# Altium project Carrier-Board-Apalis.PrjPcb (part 2 of 2)

## Sheet Sata.SchDoc
size A3; PageSetup: Record=PageOptions|CenterHorizontal=True|CenterVertical=True|PrintScale=0.73|XCorrection=1.00|YCorrection=1.00|PrintKind=0|BorderSize=5000000|LeftOffset=0|BottomOffset=0|Orientation=2|PaperLength=1000|PaperWidth=1000|Scale=100|PaperSource=7|PrintQuality=-4|MediaType=1|DitherType=10|PaperKind=A4|PrintScaleMode=1; Date: 27.05.2014; DrawnBy: luths8; Organization: BFH; Address1: Bern University of Applied Sciences; Address2: Engineering and Information Technology; Address3: Jlcoweg 1; Address4: CH-3400 Burgdorf; DocumentNumber: 12; Revision: 1.1; SheetNumber: 12; SheetTotal: 16; CurrentDate: 27.05.2014
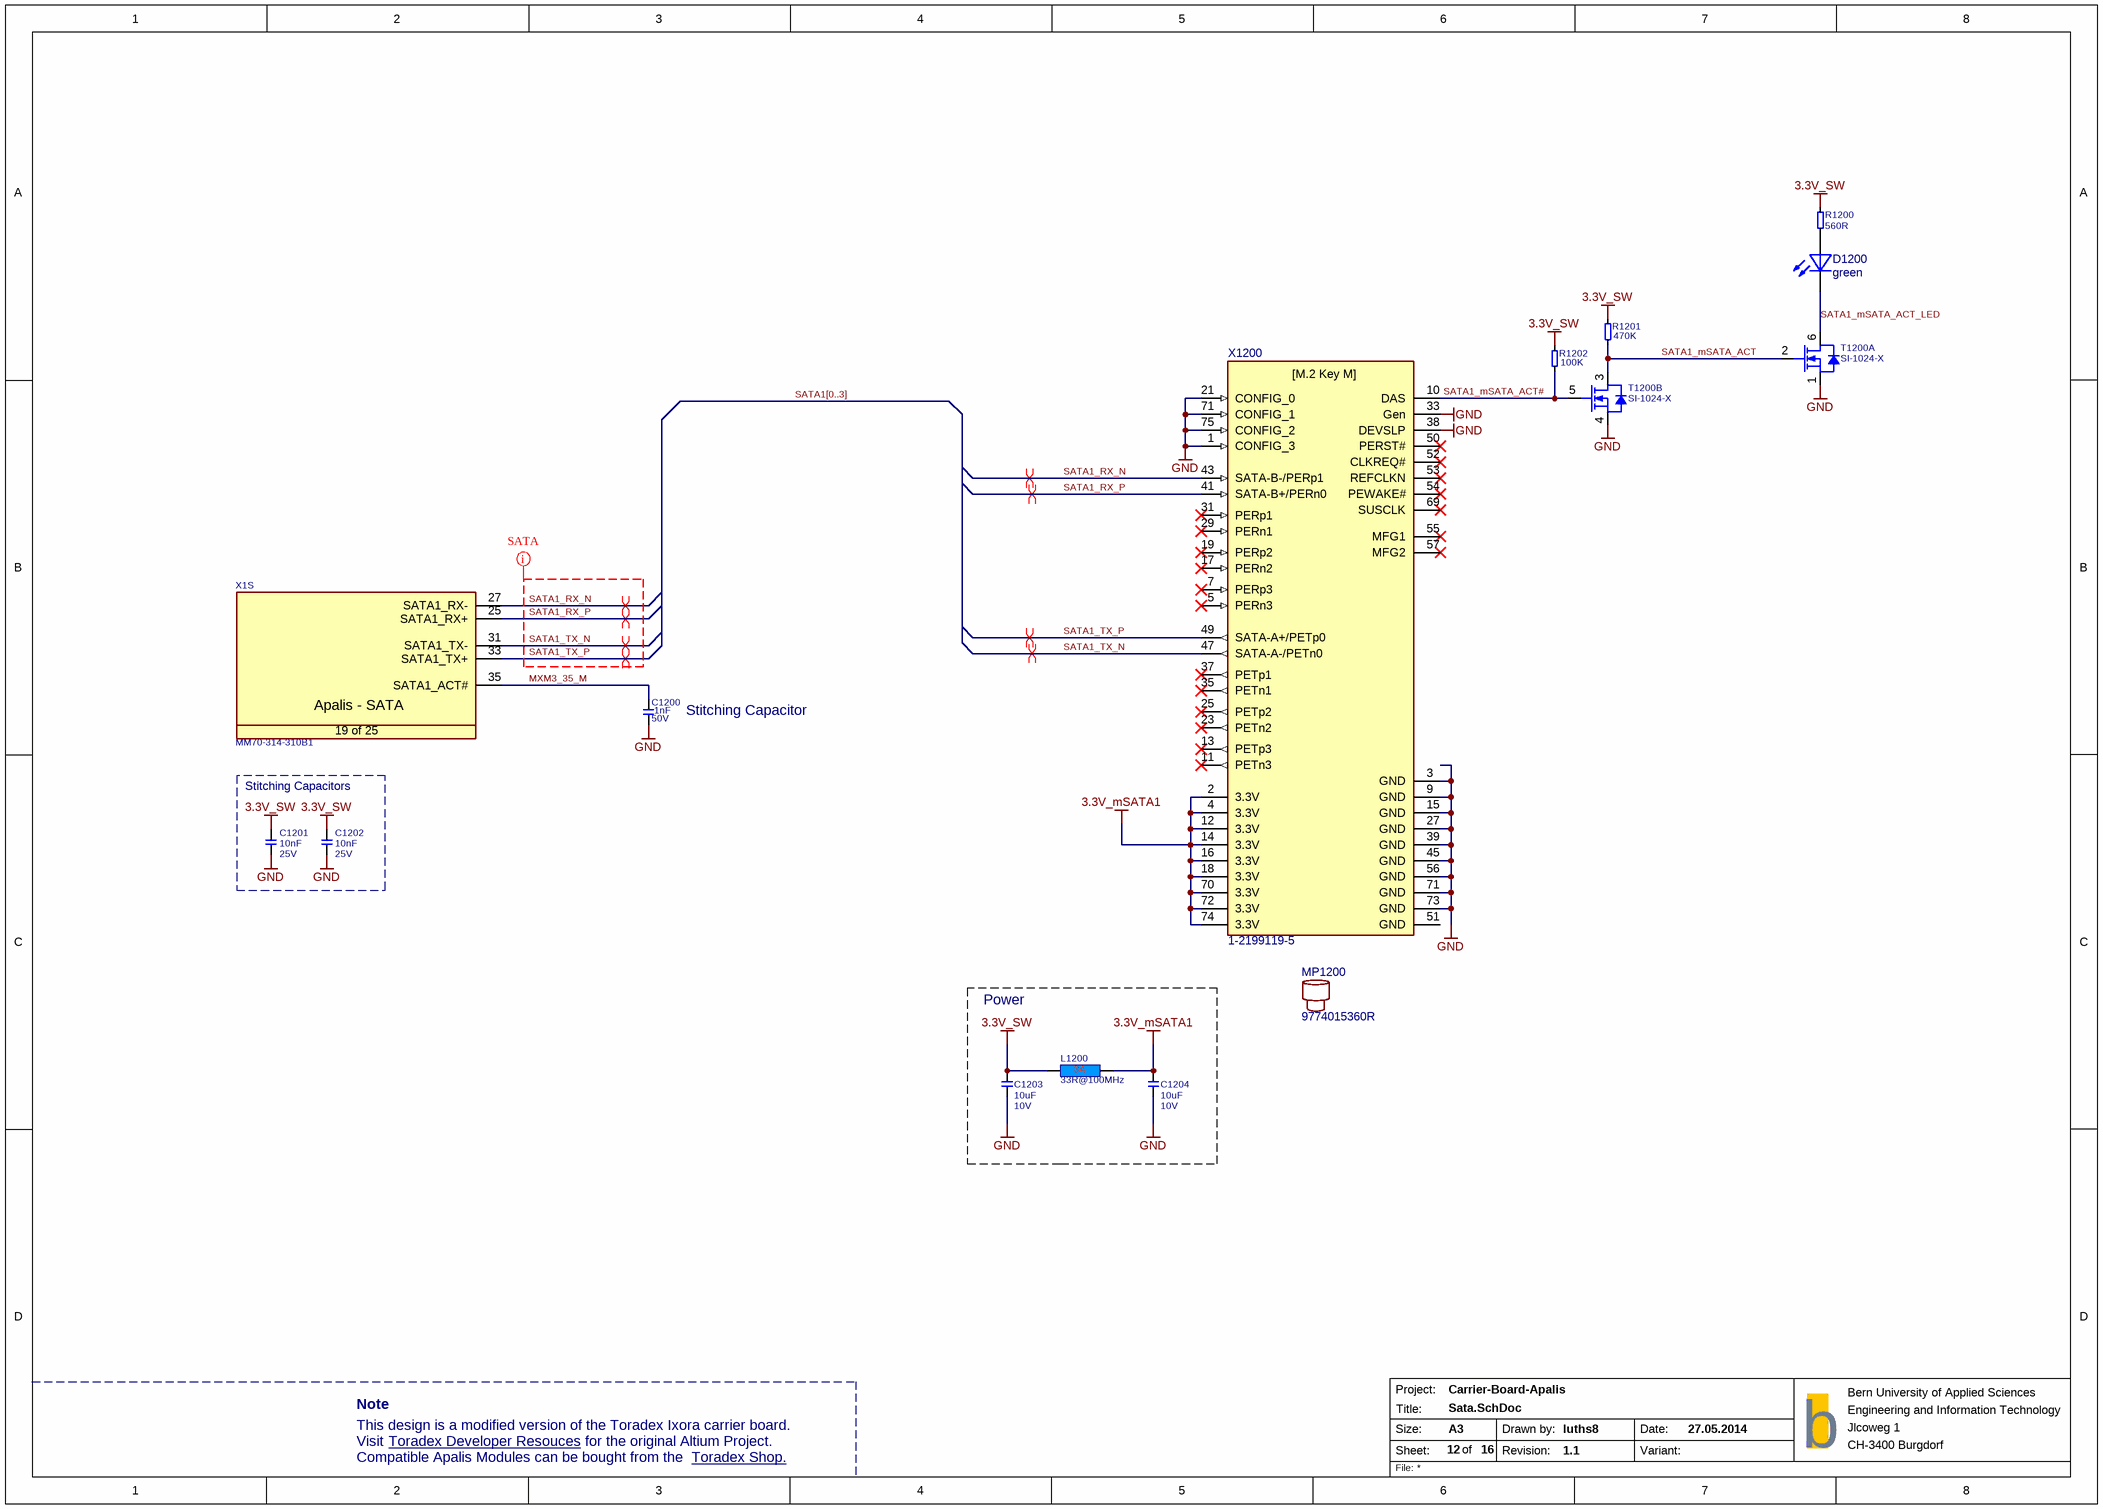
[diagram p7: Sata.SchDoc]

### Parts
C1200  Rating: 50V  [SMD0603CAP]  (hidden comment: 1nF)
C1201  10nF  Rating: 25V  [SMD0603CAP]
C1202  10nF  Rating: 25V  [SMD0603CAP]
C1203  Rating: 10V  [SMD0603CAP]  (hidden comment: 10uF)
C1204  Rating: 10V  [SMD0603CAP]  (hidden comment: 10uF)
D1200  green  [LED]
L1200  33R@100MHz  [INDC1608X95N]
MP1200  9774015360R
R1200  560R  [SMD0603RES]
R1201  470K  [SMD0603RES]
R1202  100K  [SMD0603RES]
T1200  Manufacturer Part No.: SI-1024-X  [SOTFL50P160X60-6N]  (hidden comment: T-Vishay-SI-1024X-N)  (parts A,B of 2)
X1  Manufacturer Part No.: MM70-314-310B1  [T_JAE_MM70-314-310B1]  (hidden comment: CON-JAE-MM70-314-310B1-314-0.5mm)  (part S of 25)
X1200  1-2199119-5  [1-2199119-5-Key-M-2280]

### Blocks framed on the sheet
Stitching Capacitors: C1201 C1202
Power: C1203 C1204 L1200

### Nets
3.3V_mSATA1: C1204.2 L1200.2 X1200.2(3.3V) X1200.4(3.3V) X1200.12(3.3V) X1200.14(3.3V) X1200.16(3.3V) X1200.18(3.3V) X1200.70(3.3V) X1200.72(3.3V) X1200.74(3.3V)
3.3V_SW: C1201.2 C1202.2 C1203.2 L1200.1 R1200.1 R1201.1 R1202.2
GND: C1200.1 C1201.1 C1202.1 C1203.1 C1204.1 T1200.1(S) T1200.4(S) X1200.1(CONFIG_3) X1200.3(GND) X1200.9(GND) X1200.15(GND) X1200.21(CONFIG_0) X1200.27(GND) X1200.33(Gen) X1200.38(DEVSLP) X1200.39(GND) X1200.45(GND) X1200.56(GND) X1200.71(GND) X1200.73(GND) X1200.75(CONFIG_2)
MXM3_35_M: C1200.2 X1.35(SATA1_ACT#)
SATA1_mSATA_ACT: R1201.2 T1200.2(G) T1200.3(D)
SATA1_mSATA_ACT#: R1202.1 T1200.5(G) X1200.10(DAS)
SATA1_mSATA_ACT_LED: D1200.C T1200.6(D)
SATA1_RX_N: X1.27(SATA1_RX-) X1200.43(SATA-B-/PERp1)
SATA1_RX_P: X1.25(SATA1_RX+) X1200.41(SATA-B+/PERn0)
SATA1_TX_N: X1.31(SATA1_TX-) X1200.47(SATA-A-/PETn0)
SATA1_TX_P: X1.33(SATA1_TX+) X1200.49(SATA-A+/PETp0)
NetD1200_A: D1200.A R1200.2

Not connected (* = marked no-connect by the designer): X1200 5(PERn3)* 7(PERp3)* 11(PETn3)* 13(PETp3)* 17(PERn2)* 19(PERp2)* 23(PETn2)* 25(PETp2)* 29(PERn1)* 31(PERp1)* 35(PETn1)* 37(PETp1)* 50(PERST#)* 51(GND) 52(CLKREQ#)* 53(REFCLKN)* 54(PEWAKE#)* 55(MFG1)* 57(MFG2)* 69(SUSCLK)*

### Buses and harness runs
bus SATA1[0..3]

### Layout directives
differential pair: SATA1_RX_N, SATA1_RX_P, SATA1_TX_N, SATA1_TX_P
net class SATA: SATA1_RX_N, SATA1_RX_P, SATA1_TX_N, SATA1_TX_P

### Notes on the sheet
- (near C1200) Stitching Capacitor
- Note
- This design is a modified version of the Toradex Ixora carrier board.
- Visit
- Compatible Apalis Modules can be bought from the
- Toradex Developer Resouces <https://developer.toradex.com/products/ixora-carrier-board>
- for the original Altium Project.
- Toradex Shop. <https://www.toradex.com/order-now/apalis-arm-family>
- Project:
- Size:
- Sheet:
- Title:
- A3
- of
- Drawn by:
- Revision:
- Date:
- Variant:
- b
- File:
- (in symbol CON-JAE-MM70-314-310B1-314-0.5mm, part S) Apalis - SATA; 19 of 25

### Library data of the parts
C1200 = C-X7R-1nF-50V-10%-0402: Capacitor Ceramic X7R 1nF 50V 10% 0603; Tolerance: 10%; Type: X7R; Value: 1nF
C1201 C1202 = C-X7R-10nF-25V-10%-0603: Capacitor Ceramic X7R 10nF 25V 10% 0603; Tolerance: 10%; Type: X7R; Value: 10nF
C1203 C1204 = C-X5R-10uF-10V-20%-0603: Capacitor Ceramic X5R 10uF 10V 20% 0603; Tolerance: 20%; Type: X5R; Value: 10uF
D1200 = LED green: Manufacturer Part No.: LGM67KG1J224Z
L1200 = L-33R@100MHz-3A-25%-0603: 33R@100MHz 3A EMI FILTER; Tolerance: 25%; Rating: 3A; Value: 33R@100MHz
MP1200 = Spacer M3 SMD: Manufacturer Part No.: 9774015360R
R1200 = R-560R-63mW-5%-0402: Resistor 560 ohm 63mW 5% 0603; Rating: 63mW; Tolerance: 5%; Value: 560R
R1201 = R-470KR-63mW-5%-0402: Resistor 470 Kohm 63mW 5% 0603; Value: 470KR; Rating: 63mW; Tolerance: 5%
R1202 = R-100KR-63mW-5%-0402: as R302 on sheet Power_Switch; Rating: 63mW; Tolerance: 5%
T1200 = T-Vishay-SI-1024X-N: as T302 on sheet Power_Switch
X1 = CON-JAE-MM70-314-310B1-314-0.5mm: as X1 on sheet Ethernet
X1200 = Connector M.2 Key M: Manufacturer Part No.: 1-2199119-5

## Sheet Serial.SchDoc
size A3; PageSetup: Record=PageOptions|CenterHorizontal=True|CenterVertical=True|PrintScale=0.73|XCorrection=1.00|YCorrection=1.00|PrintKind=0|BorderSize=5000000|LeftOffset=0|BottomOffset=0|Orientation=2|PaperLength=1000|PaperWidth=1000|Scale=100|PaperSource=7|PrintQuality=-4|MediaType=1|DitherType=10|PaperKind=A4|PrintScaleMode=1; Date: 27.05.2014; DrawnBy: luths8; Organization: BFH; Address1: Bern University of Applied Sciences; Address2: Engineering and Information Technology; Address3: Jlcoweg 1; Address4: CH-3400 Burgdorf; DocumentNumber: 11; Revision: 1.1; SheetNumber: 11; SheetTotal: 16; CurrentDate: 27.05.2014
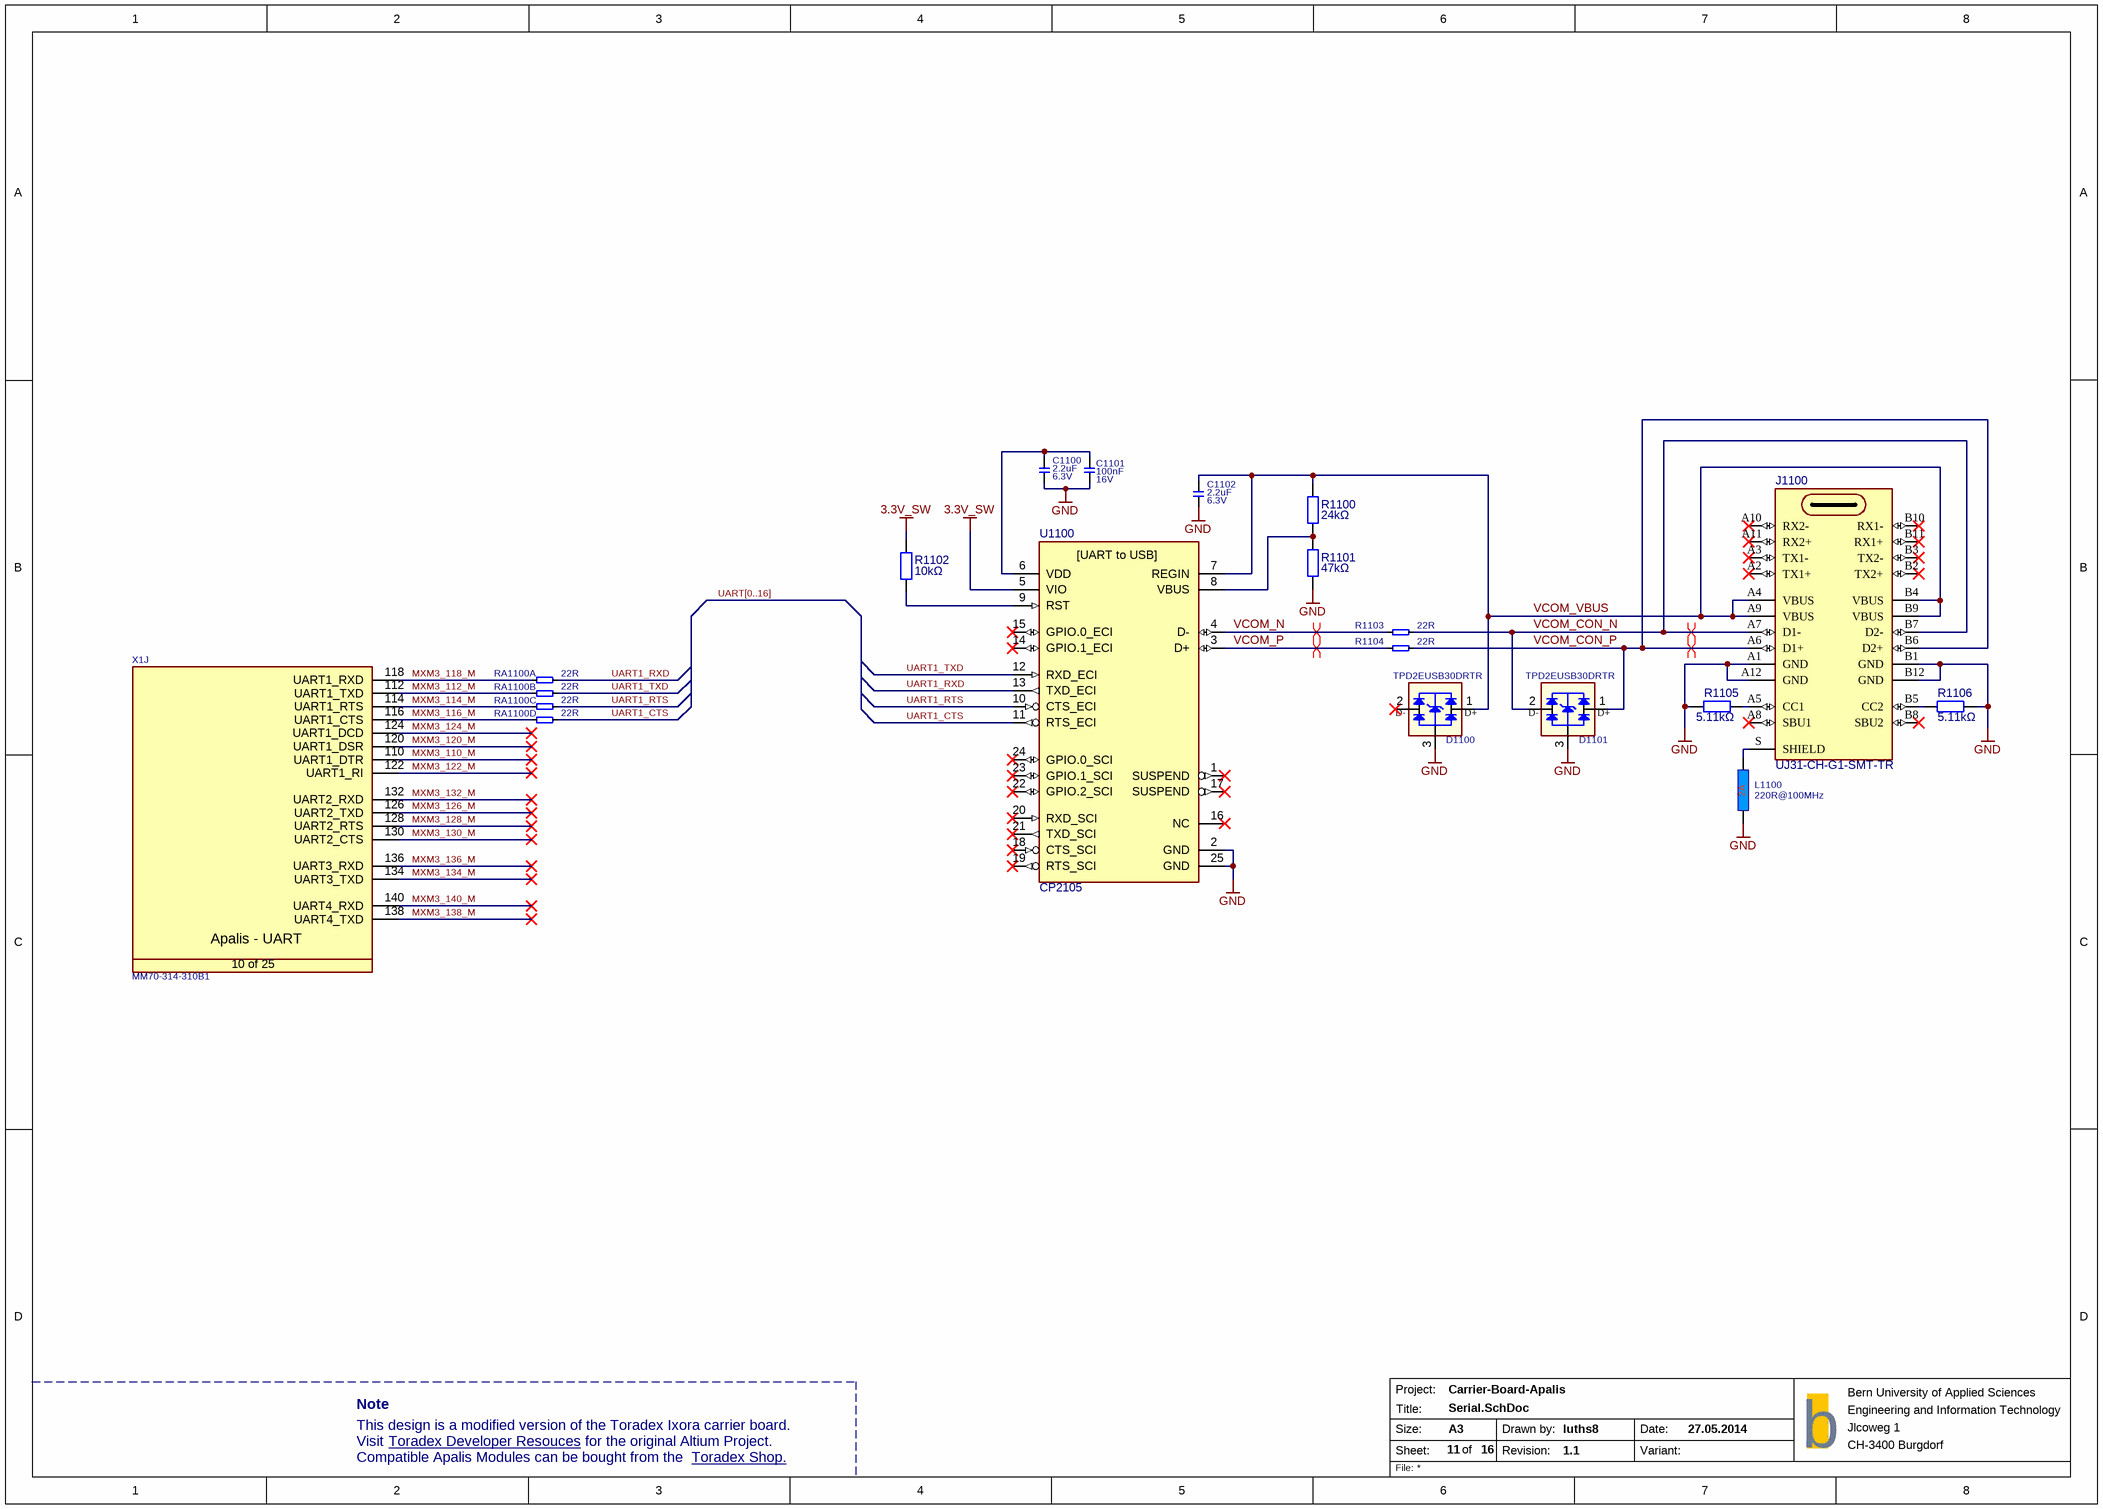
[diagram p8: Serial.SchDoc]

### Parts
C1100  Rating: 6.3V  [SMD0603CAP]  (hidden comment: 2.2uF)
C1101  Rating: 16V  [SMD0603CAP]  (hidden comment: 100nF)
C1102  Rating: 6.3V  [SMD0603CAP]  (hidden comment: 2.2uF)
D1100  TPD2EUSB30DRTR  [T_TI_TPD2EUSB30DRTR]
D1101  TPD2EUSB30DRTR  [T_TI_TPD2EUSB30DRTR]
J1100  UJ31-CH-G1-SMT-TR  [UJ31-CH-G1-SMT-TR]
L1100  220R@100MHz  [INDC1608X95N]
R1100  24kΩ  [SMD0603RES]
R1101  47kΩ  [SMD0603RES]
R1102  10kΩ  [SMD0603RES]
R1103  22R  [SMD0603RES]
R1104  22R  [SMD0603RES]
R1105  5.11kΩ  [SMD0603RES]
R1106  5.11kΩ  [SMD0603RES]
RA1100  22R  [T_Resistor_Array_X4]  (parts A,B,C,D of 4)
U1100  CP2105  [QFN24]
X1  Manufacturer Part No.: MM70-314-310B1  [T_JAE_MM70-314-310B1]  (hidden comment: CON-JAE-MM70-314-310B1-314-0.5mm)  (part J of 25)

### Nets
3.3V_SW: R1102.2 U1100.5(VIO)
GND: C1100.1 C1101.1 C1102.1 D1100.3 D1101.3 J1100.A1(GND) J1100.A12(GND) J1100.B1(GND) J1100.B12(GND) L1100.1 R1101.1 R1105.1 R1106.1 U1100.2(GND) U1100.25(GND)
MXM3_110_M: X1.110(UART1_DTR)
MXM3_112_M: RA1100.1 X1.112(UART1_TXD)
MXM3_114_M: RA1100.2 X1.114(UART1_RTS)
MXM3_116_M: RA1100.3 X1.116(UART1_CTS)
MXM3_118_M: RA1100.4 X1.118(UART1_RXD)
MXM3_120_M: X1.120(UART1_DSR)
MXM3_122_M: X1.122(UART1_RI)
MXM3_124_M: X1.124(UART1_DCD)
MXM3_126_M: X1.126(UART2_TXD)
MXM3_128_M: X1.128(UART2_RTS)
MXM3_130_M: X1.130(UART2_CTS)
MXM3_132_M: X1.132(UART2_RXD)
MXM3_134_M: X1.134(UART3_TXD)
MXM3_136_M: X1.136(UART3_RXD)
MXM3_138_M: X1.138(UART4_TXD)
MXM3_140_M: X1.140(UART4_RXD)
UART1_CTS: RA1100.7 U1100.11(RTS_ECI)
UART1_RTS: RA1100.6 U1100.10(CTS_ECI)
UART1_RXD: RA1100.8 U1100.13(TXD_ECI)
UART1_TXD: RA1100.5 U1100.12(RXD_ECI)
VCOM_CON_N: D1101.2(D-) J1100.A7(D1-) J1100.B7(D2-) R1103.2
VCOM_CON_P: D1101.1(D+) J1100.A6(D1+) J1100.B6(D2+) R1104.2
VCOM_N: R1103.1 U1100.4(D-)
VCOM_P: R1104.1 U1100.3(D+)
VCOM_VBUS: C1102.2 D1100.1(D+) J1100.A4(VBUS) J1100.A9(VBUS) J1100.B4(VBUS) J1100.B9(VBUS) R1100.2 U1100.7(REGIN)
NetC1100_2: C1100.2 C1101.2 U1100.6(VDD)
NetJ1100_A5: J1100.A5(CC1) R1105.2
NetJ1100_B5: J1100.B5(CC2) R1106.2
NetJ1100_S: J1100.S(SHIELD) L1100.2
NetR1100_1: R1100.1 R1101.2 U1100.8(VBUS)
NetR1102_1: R1102.1 U1100.9(RST)

Not connected (* = marked no-connect by the designer): D1100 2(D-)*; J1100 A2(TX1+)* A3(TX1-)* A8(SBU1)* A10(RX2-)* A11(RX2+)* B2(TX2+)* B3(TX2-)* B8(SBU2)* B10(RX1-)* B11(RX1+)*; U1100 1(SUSPEND)* 14(GPIO.1_ECI)* 15(GPIO.0_ECI)* 16(NC)* 17(SUSPEND)* 18(CTS_SCI)* 19(RTS_SCI)* 20(RXD_SCI)* 21(TXD_SCI)* 22(GPIO.2_SCI)* 23(GPIO.1_SCI)* 24(GPIO.0_SCI)*

### Buses and harness runs
bus UART[0..16]

### Layout directives
differential pair: VCOM_CON_N, VCOM_CON_P, VCOM_N, VCOM_P

### Notes on the sheet
- Note
- This design is a modified version of the Toradex Ixora carrier board.
- Visit
- Compatible Apalis Modules can be bought from the
- Toradex Developer Resouces <https://developer.toradex.com/products/ixora-carrier-board>
- for the original Altium Project.
- Toradex Shop. <https://www.toradex.com/order-now/apalis-arm-family>
- Project:
- Size:
- Sheet:
- Title:
- A3
- of
- Drawn by:
- Revision:
- Date:
- Variant:
- b
- File:
- (in symbol CON-JAE-MM70-314-310B1-314-0.5mm, part J) Apalis - UART; 10 of 25
- (in symbol CP2105) [UART to USB]

### Library data of the parts
C1100 C1102 = C-X5R-2.2uF-6.3V-20%-0603: as C329 on sheet Power_Switch; Tolerance: 20%; Type: X5R; Value: 2.2uF
C1101 = C-X7R-100nF-16V-10%-0402: Capacitor Ceramic X7R 100nF 16V 10% 0603; Tolerance: 10%; Type: X7R; Value: 100nF
D1100 D1101 = D-TI-TPD2EUSB30DRTR: 2 Channel Protection for Super Speed USB3.0; Manufacturer Name: TI; Manufacturer Part No.: TPD2EUSB30DRTR
J1100 = Connector USB C: USB Type C Jack; Manufacturer Part No.: UJ31-CH-G1-SMT-TR
L1100 = L-220R@100MHz-2A-25%-0603: as L700 on sheet Ethernet; Rating: 2A; Value: 220R@100MHz
R1100-R1102 R1105 R1106 = Resistor
R1103 R1104 = R-22R-63mW-5%-0402: Resistor 22 ohm 63mW 5% 0603; Rating: 63mW; Tolerance: 5%; Value: 22R
RA1100 = RA-22R-63mW-5%-1206-div: Resistor Array 22 R 63mW 5% 1206; Tolerance: 5%; Power Dissipation: 63mW; Value: 22R
U1100 = CP2105: USB to UART Bridge; Manufacturer Part No.: CP2105-F01-GMR
X1 = CON-JAE-MM70-314-310B1-314-0.5mm: as X1 on sheet Ethernet

## Sheet Extension.SchDoc
size A3; PageSetup: Record=PageOptions|CenterHorizontal=True|CenterVertical=True|PrintScale=0.73|XCorrection=1.00|YCorrection=1.00|PrintKind=0|BorderSize=5000000|LeftOffset=0|BottomOffset=0|Orientation=2|PaperLength=1000|PaperWidth=1000|Scale=100|PaperSource=7|PrintQuality=-4|MediaType=1|DitherType=10|PaperKind=A4|PrintScaleMode=1; Date: 27.05.2014; DrawnBy: luths8; Organization: BFH; Address1: Bern University of Applied Sciences; Address2: Engineering and Information Technology; Address3: Jlcoweg 1; Address4: CH-3400 Burgdorf; DocumentNumber: 14; Revision: 1.1; SheetNumber: 14; SheetTotal: 16; CurrentDate: 27.05.2014
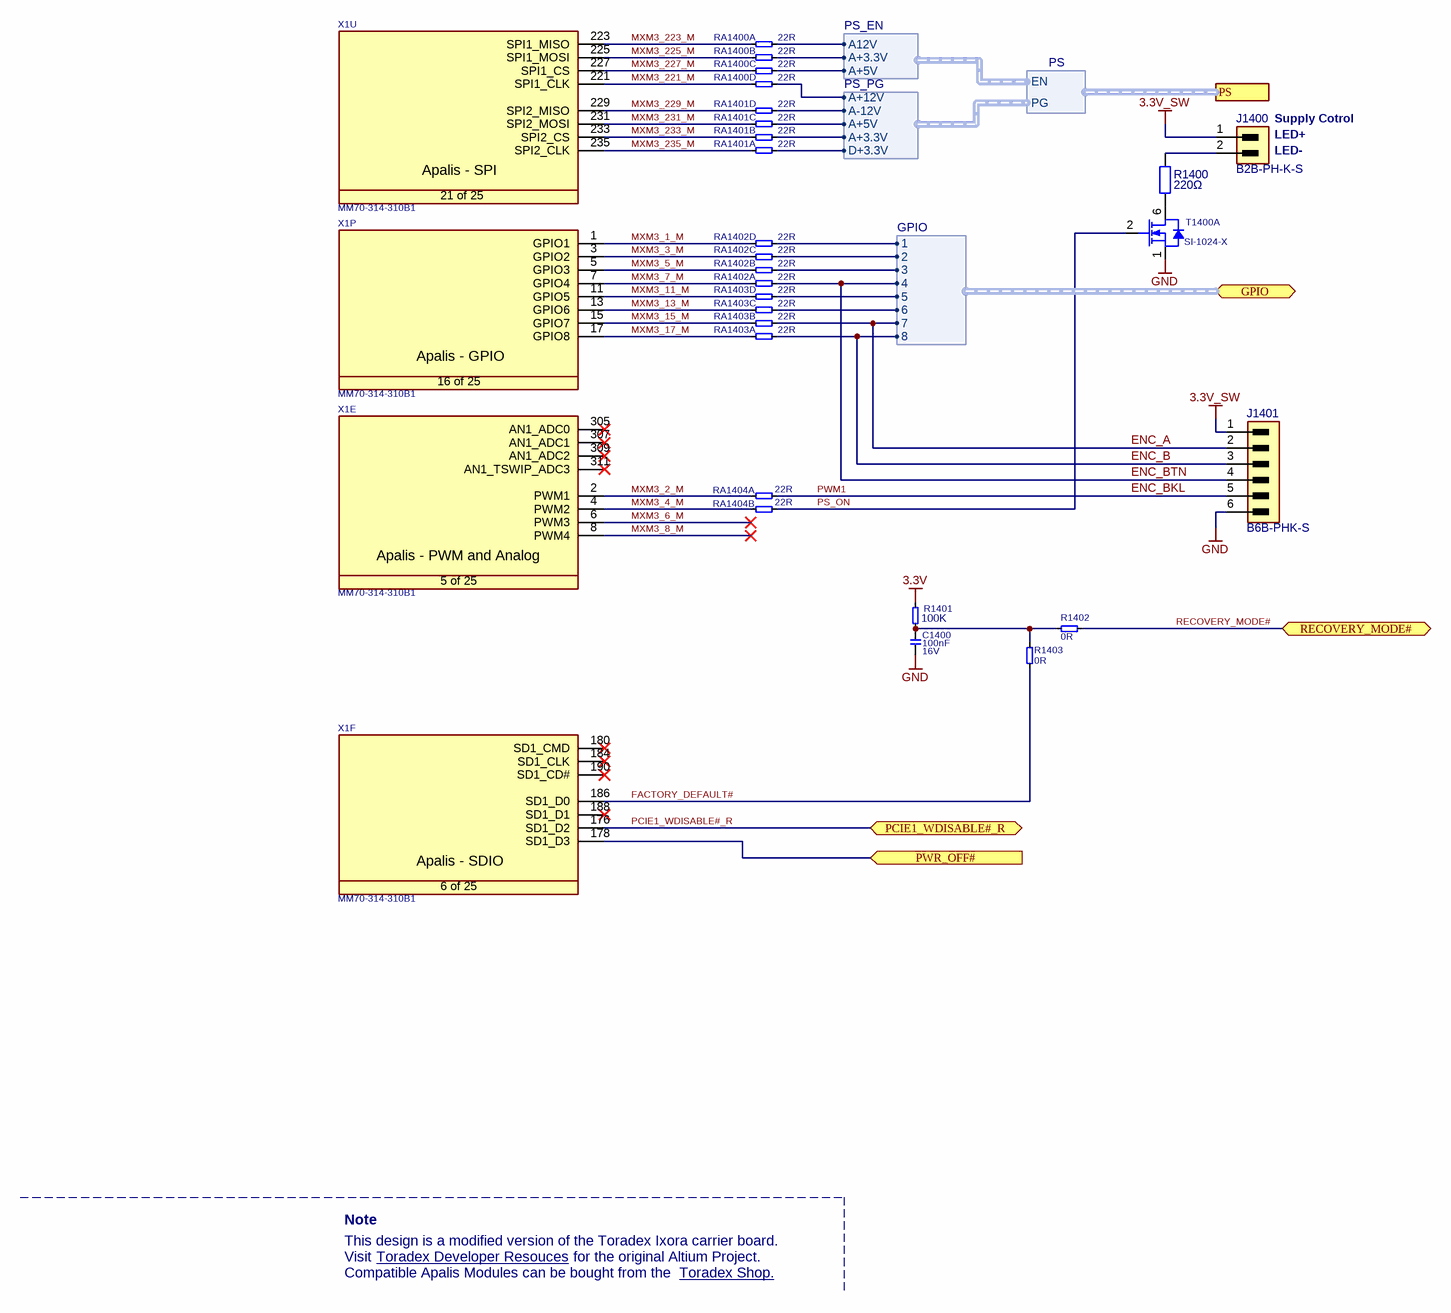
[diagram p9: Extension.SchDoc]

### Parts
C1400  Rating: 16V  [SMD0603CAP]  (hidden comment: 100nF)
J1400  B2B-PH-K-S  [B2B-PH-K-S]
J1401  B6B-PHK-S  [B6B-PH-K-S]
R1400  220Ω  [SMD0603RES]
R1401  100K  [SMD0603RES]
R1402  0R  [SMD0603RES]
R1403  0R  [SMD0603RES]
RA1400  22R  [T_Resistor_Array_X4]  (parts A,B,C,D of 4)
RA1401  22R  [T_Resistor_Array_X4]  (parts A,B,C,D of 4)
RA1402  22R  [T_Resistor_Array_X4]  (parts A,B,C,D of 4)
RA1403  22R  [T_Resistor_Array_X4]  (parts A,B,C,D of 4)
RA1404  22R  [T_Resistor_Array_X4]  (parts A,B of 4)
T1400  Manufacturer Part No.: SI-1024-X  [SOTFL50P160X60-6N]  (hidden comment: T-Vishay-SI-1024X-N)  (part A of 2)
X1  Manufacturer Part No.: MM70-314-310B1  [T_JAE_MM70-314-310B1]  (hidden comment: CON-JAE-MM70-314-310B1-314-0.5mm)  (parts E,F,P,U of 25)

### Ports
GPIO (bidir, harness GPIO, see 11, 12, 4), PCIE1_WDISABLE#_R (bidir, see 18), PS (harness PS), PWR_OFF# (in, see 18), RECOVERY_MODE# (bidir, see 11)

### Harnesses
PS: EN, PG
GPIO: 1, 2, 3, 4, 5, 6, 7, 8
PS_EN: A12V, A+3.3V, A+5V
PS_PG: A+12V, A-12V, A+3.3V, A+5V, D+3.3V

### Nets
3.3V: R1401.1
3.3V_SW: J1400.1 J1401.1
GND: C1400.1 J1401.6 T1400.1(S)
DAC_MUTE: RA1402.8 ; port GPIO.1
ENC_A: J1401.2 RA1403.6 ; port GPIO.7
ENC_B: J1401.3 RA1403.5 ; port GPIO.8
ENC_BKL: J1401.5 RA1404.1  [also labelled PWM1]
ENC_BTN: J1401.4 RA1402.5 ; port GPIO.4
FACTORY_DEFAULT#: R1403.1 X1.186(SD1_D0)
INT#: X1.178(SD1_D3) ; port PWR_OFF#
MXM3_1_M: RA1402.4 X1.1(GPIO1)
MXM3_2_M: RA1404.5 X1.2(PWM1)
MXM3_3_M: RA1402.3 X1.3(GPIO2)
MXM3_4_M: RA1404.6 X1.4(PWM2)
MXM3_5_M: RA1402.2 X1.5(GPIO3)
MXM3_6_M: X1.6(PWM3)
MXM3_7_M: RA1402.1 X1.7(GPIO4)
MXM3_8_M: X1.8(PWM4)
MXM3_11_M: RA1403.4 X1.11(GPIO5)
MXM3_13_M: RA1403.3 X1.13(GPIO6)
MXM3_15_M: RA1403.2 X1.15(GPIO7)
MXM3_17_M: RA1403.1 X1.17(GPIO8)
MXM3_221_M: RA1400.4 X1.221(SPI1_CLK)
MXM3_223_M: RA1400.1 X1.223(SPI1_MISO)
MXM3_225_M: RA1400.2 X1.225(SPI1_MOSI)
MXM3_227_M: RA1400.3 X1.227(SPI1_CS)
MXM3_229_M: RA1401.4 X1.229(SPI2_MISO)
MXM3_231_M: RA1401.3 X1.231(SPI2_MOSI)
MXM3_233_M: RA1401.2 X1.233(SPI2_CS)
MXM3_235_M: RA1401.1 X1.235(SPI2_CLK)
PCIE1_WDISABLE#_R: X1.176(SD1_D2) ; port PCIE1_WDISABLE#_R
PS_A12V_EN: RA1400.5 ; harness PS_EN.A12V
PS_A+3.3V_EN: RA1400.6 ; harness PS_EN.A+3.3V
PS_A+3.3V_PG: RA1401.6 ; harness PS_PG.A+3.3V
PS_A+5V_EN: RA1400.7 ; harness PS_EN.A+5V
PS_A+5V_PG: RA1401.7 ; harness PS_PG.A+5V
PS_A+12V_PG: RA1400.8 ; harness PS_PG.A+12V
PS_A-12V_PG: RA1401.8 ; harness PS_PG.A-12V
PS_D+3.3V_PG: RA1401.5 ; harness PS_PG.D+3.3V
PS_ON: RA1404.2 T1400.2(G)
RECOVERY_MODE#: R1402.2 ; port RECOVERY_MODE#
REF_CLK_EN_1: RA1402.7 ; port GPIO.2
REF_CLK_EN_2: RA1402.6 ; port GPIO.3
TOUCH_INT#: RA1403.8 ; port GPIO.5
TOUCH_RESET#: RA1403.7 ; port GPIO.6
NetC1400_2: C1400.2 R1401.2 R1402.1 R1403.2
NetJ1400_2: J1400.2 R1400.2
NetR1400_1: R1400.1 T1400.6(D)

Not connected (* = marked no-connect by the designer): X1 180(SD1_CMD)* 184(SD1_CLK)* 188(SD1_D1)* 190(SD1_CD#)* 305(AN1_ADC0)* 307(AN1_ADC1)* 309(AN1_ADC2)* 311(AN1_TSWIP_ADC3)*

### Notes on the sheet
- (near J1400) Supply Cotrol
- (near J1400) LED+
- (near J1400) LED-
- Note
- This design is a modified version of the Toradex Ixora carrier board.
- Visit
- Compatible Apalis Modules can be bought from the
- Toradex Developer Resouces <https://developer.toradex.com/products/ixora-carrier-board>
- for the original Altium Project.
- Toradex Shop. <https://www.toradex.com/order-now/apalis-arm-family>
- Project:
- Size:
- Sheet:
- Title:
- A3
- of
- Drawn by:
- Revision:
- Date:
- Variant:
- b
- File:
- (in symbol CON-JAE-MM70-314-310B1-314-0.5mm, part E) Apalis - PWM and Analog; 5 of 25
- (in symbol CON-JAE-MM70-314-310B1-314-0.5mm, part F) Apalis - SDIO; 6 of 25
- (in symbol CON-JAE-MM70-314-310B1-314-0.5mm, part P) Apalis - GPIO; 16 of 25
- (in symbol CON-JAE-MM70-314-310B1-314-0.5mm, part U) Apalis - SPI; 21 of 25

### Library data of the parts
C1400 = C-X7R-100nF-16V-10%-0402: Capacitor Ceramic X7R 100nF 16V 10% 0603; Tolerance: 10%; Type: X7R; Value: 100nF
J1400 = Connector 2x1P: Manufacturer Part No.: B2B-PH-K-S; System: Connector
J1401 = Connector 6x1P: Manufacturer Part No.: B6B-PHK-S; System: Connector
R1400 = Resistor
R1401 = R-100KR-63mW-5%-0402: Resistor 100 Kohm 63mW 5% 0603; Value: 100KR; Rating: 63mW; Tolerance: 5%
R1402 R1403 = R-0R-63mW-1%-0603: Resistor 0 ohm 63mW 1% 0603; Rating: 63mW; Tolerance: 1%; Value: 0R
RA1400-RA1404 = RA-22R-63mW-5%-1206-div: Resistor Array 22 R 63mW 5% 1206; Tolerance: 5%; Power Dissipation: 63mW; Value: 22R
T1400 = T-Vishay-SI-1024X-N: Dual N-Channel 20V (D-S)  MOSFET; Manufacturer Name: Vishay
X1 = CON-JAE-MM70-314-310B1-314-0.5mm: MXM3 Connector; Manufacturer Name: JAE; No. of ways: 314

## Sheet USB_Connectors.SchDoc
size A3; PageSetup: Record=PageOptions|CenterHorizontal=True|CenterVertical=True|PrintScale=0.71|XCorrection=1.00|YCorrection=1.00|PrintKind=0|BorderSize=5000000|LeftOffset=0|BottomOffset=0|Orientation=2|PaperLength=1000|PaperWidth=1000|Scale=100|PaperSource=7|PrintQuality=-4|MediaType=1|DitherType=10|PaperKind=A4|PrintScaleMode=1; Date: 27.05.2014; DrawnBy: luths8; Organization: BFH; Address1: Bern University of Applied Sciences; Address2: Engineering and Information Technology; Address3: Jlcoweg 1; Address4: CH-3400 Burgdorf; DocumentNumber: 6; Revision: 1.1; SheetNumber: 6; SheetTotal: 16; CurrentDate: 27.05.2014
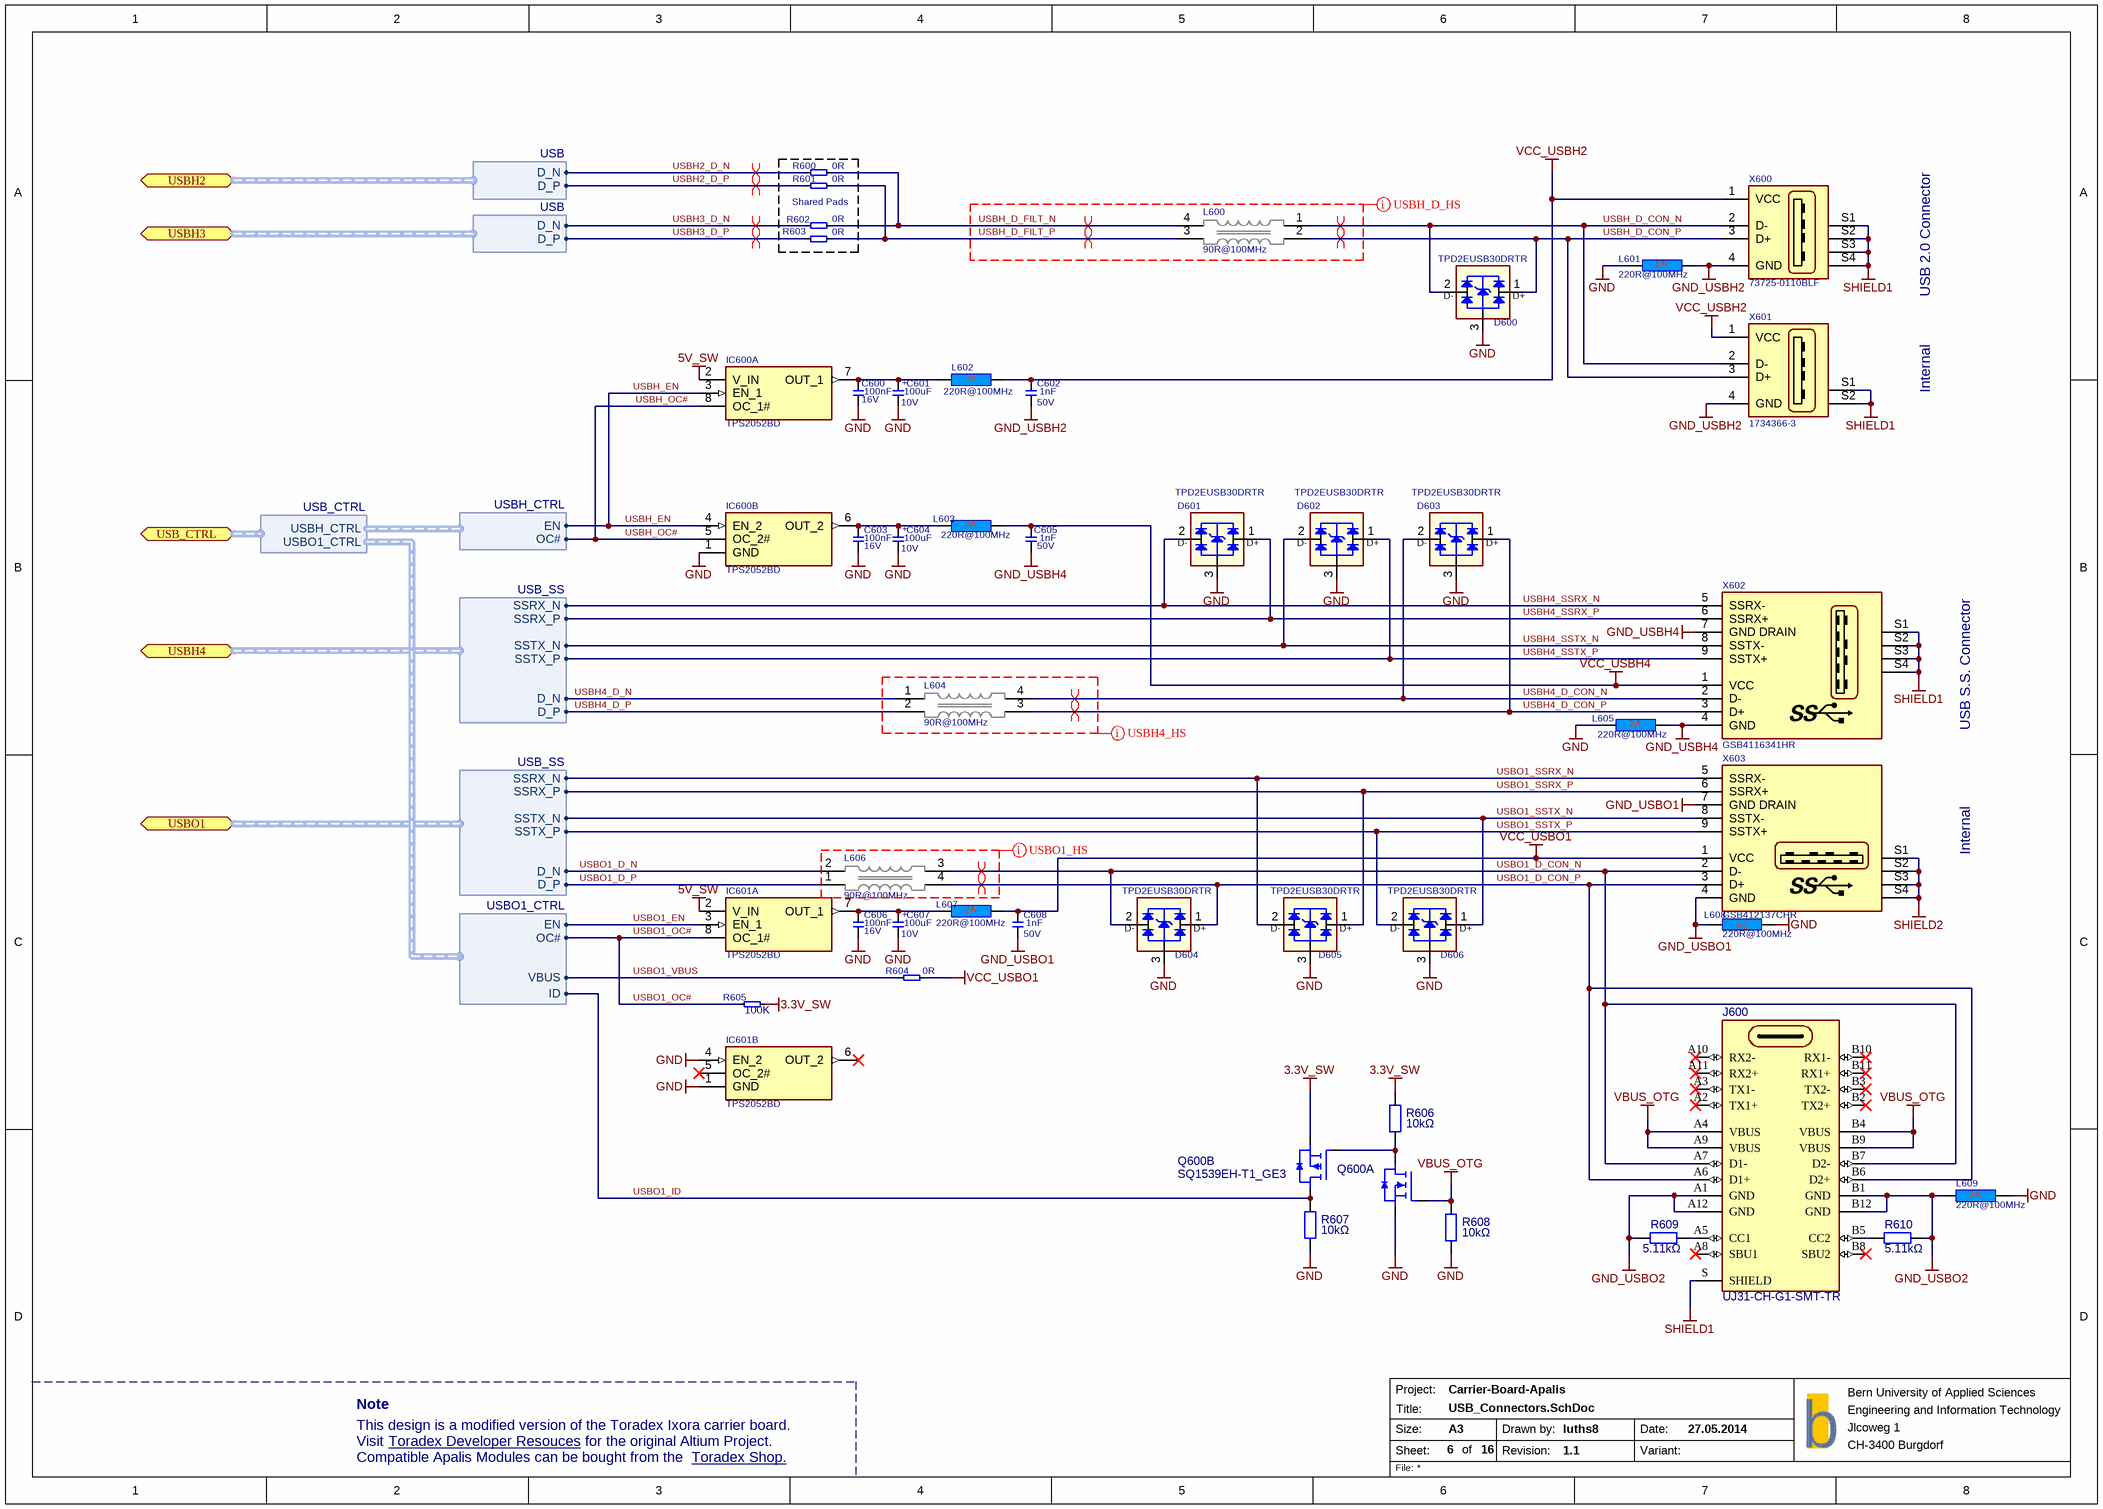
[diagram p10: USB_Connectors.SchDoc]

### Parts
C600  Rating: 16V  [SMD0603CAP]  (hidden comment: 100nF)
C601  Rating: 10V  [CAPMP6032X280N]  (hidden comment: 100uF)
C602  Rating: 50V  [SMD0603CAP]  (hidden comment: 1nF)
C603  Rating: 16V  [SMD0603CAP]  (hidden comment: 100nF)
C604  Rating: 10V  [CAPMP6032X280N]  (hidden comment: 100uF)
C605  Rating: 50V  [SMD0603CAP]  (hidden comment: 1nF)
C606  Rating: 16V  [SMD0603CAP]  (hidden comment: 100nF)
C607  Rating: 10V  [CAPMP6032X280N]  (hidden comment: 100uF)
C608  Rating: 50V  [SMD0603CAP]  (hidden comment: 1nF)
D600  TPD2EUSB30DRTR  [T_TI_TPD2EUSB30DRTR]
D601  TPD2EUSB30DRTR  [T_TI_TPD2EUSB30DRTR]
D602  TPD2EUSB30DRTR  [T_TI_TPD2EUSB30DRTR]
D603  TPD2EUSB30DRTR  [T_TI_TPD2EUSB30DRTR]
D604  TPD2EUSB30DRTR  [T_TI_TPD2EUSB30DRTR]
D605  TPD2EUSB30DRTR  [T_TI_TPD2EUSB30DRTR]
D606  TPD2EUSB30DRTR  [T_TI_TPD2EUSB30DRTR]
IC600  TPS2052BD  [SOIC127P600X173-8N]  (parts A,B of 2)
IC601  TPS2052BD  [SOIC127P600X173-8N]  (parts A,B of 2)
J600  UJ31-CH-G1-SMT-TR  [UJ31-CH-G1-SMT-TR]
L600  90R@100MHz  [T_Murata_DLW21SN900SQ2]
L601  220R@100MHz  [INDC1608X95N]
L602  220R@100MHz  [INDC1608X95N]
L603  220R@100MHz  [INDC1608X95N]
L604  90R@100MHz  [T_Murata_DLW21SN900SQ2]
L605  220R@100MHz  [INDC1608X95N]
L606  90R@100MHz  [T_Murata_DLW21SN900SQ2]
L607  220R@100MHz  [INDC1608X95N]
L608  220R@100MHz  [INDC1608X95N]
L609  220R@100MHz  [INDC1608X95N]
Q600  SQ1539EH-T1_GE3  [SOT-363-6]  (value not drawn)  (parts A,B of 2)
R600  0R  [SMD0603RES]
R601  0R  [SMD0603RES]
R602  0R  [SMD0603RES]
R603  0R  [SMD0603RES]
R604  0R  [SMD0603RES]
R605  100K  [SMD0603RES]
R606  10kΩ  [SMD0603RES]
R607  10kΩ  [SMD0603RES]
R608  10kΩ  [SMD0603RES]
R609  5.11kΩ  [SMD0603RES]
R610  5.11kΩ  [SMD0603RES]
X600  Manufacturer Part No.: 73725-0110BLF  [T_FCI_73725-0110BLF]  (hidden comment: CON-Fci-73725-0110BLF)
X601  CON-TE-1734366-3  [1734366-3]  (value not drawn)
X602  GSB4116341HR  [GSB4116341HR]
X603  GSB412137CHR  [GSB412137CHR]

### Blocks framed on the sheet
Shared Pads: R600-R603

### Ports
USB_CTRL (bidir, harness USB_CTRL), USBH2 (bidir, harness USB), USBH3 (bidir, harness USB), USBH4 (bidir, harness USB_SS), USBO1 (bidir, harness USB_SS)

### Harnesses
USB_SS: D_N, D_P, SSTX_N, SSTX_P, SSRX_N, SSRX_P
USBO1_CTRL: VBUS, ID, OC#, EN
USBH_CTRL: OC#, EN
USB_CTRL: USBO1_CTRL, USBH_CTRL
USB: D_N, D_P

### Nets
3.3V_SW: Q600.4(S) R605.2 R606.2
5V_SW: IC600.2(V_IN) IC601.2(V_IN)
GND: C600.1 C601.2 C603.1 C604.2 C606.1 C607.2 D600.3 D601.3 D602.3 D603.3 D604.3 D605.3 D606.3 IC600.1(GND) IC601.1(GND) IC601.4(EN_2) L601.1 L605.1 L608.1 L609.1 Q600.1(S) R607.1 R608.1
GND_USBH2: C602.1 L601.2 X600.4(GND) X601.4(GND)
GND_USBH4: C605.1 L605.2 X602.4(GND) X602.7(GND_DRAIN)
GND_USBO1: C608.1 L608.2 X603.4(GND) X603.7(GND_DRAIN)
GND_USBO2: J600.A1(GND) J600.A12(GND) J600.B1(GND) J600.B12(GND) L609.2 R609.1 R610.1
SHIELD1: J600.S(SHIELD) X600.S1 X600.S2 X600.S3 X600.S4 X601.S1 X601.S2 X602.S1 X602.S2 X602.S3 X602.S4
SHIELD2: X603.S1 X603.S2 X603.S3 X603.S4
VBUS_OTG: J600.A4(VBUS) J600.A9(VBUS) J600.B4(VBUS) J600.B9(VBUS) Q600.2(G) R608.2
VCC_USBH2: C602.2 L602.2 X600.1(VCC) X601.1(VCC)
VCC_USBH4: C605.2 L603.2 X602.1(VCC)
VCC_USBO1: C608.2 L607.2 R604.2 X603.1(VCC)
USBH2_D_N: R600.1 ; port USBH2.D_N
USBH2_D_P: R601.1 ; port USBH2.D_P
USBH3_D_N: R602.1 ; port USBH3.D_N
USBH3_D_P: R603.1 ; port USBH3.D_P
USBH4_D_CON_N: D603.2(D-) L604.4 X602.2(D-)
USBH4_D_CON_P: D603.1(D+) L604.3 X602.3(D+)
USBH4_D_N: L604.1 ; port USBH4.D_N
USBH4_D_P: L604.2 ; port USBH4.D_P
USBH4_SSRX_N: D601.2(D-) X602.5(SSRX-) ; port USBH4.SSRX_N
USBH4_SSRX_P: D601.1(D+) X602.6(SSRX+) ; port USBH4.SSRX_P
USBH4_SSTX_N: D602.2(D-) X602.8(SSTX-) ; port USBH4.SSTX_N
USBH4_SSTX_P: D602.1(D+) X602.9(SSTX+) ; port USBH4.SSTX_P
USBH_D_CON_N: D600.2(D-) L600.1 X600.2(D-) X601.2(D-)
USBH_D_CON_P: D600.1(D+) L600.2 X600.3(D+) X601.3(D+)
USBH_D_FILT_N: L600.4 R600.2 R602.2
USBH_D_FILT_P: L600.3 R601.2 R603.2
USBH_EN: IC600.3(EN_1) IC600.4(EN_2) ; harness USBH_CTRL.EN
USBH_OC#: IC600.5(OC_2#) IC600.8(OC_1#) ; harness USBH_CTRL.OC#
USBO1_D_CON_N: D604.2(D-) J600.A7(D1-) J600.B7(D2-) L606.3 X603.2(D-)
USBO1_D_CON_P: D604.1(D+) J600.A6(D1+) J600.B6(D2+) L606.4 X603.3(D+)
USBO1_D_N: L606.2 ; port USBO1.D_N
USBO1_D_P: L606.1 ; port USBO1.D_P
USBO1_EN: IC601.3(EN_1) ; harness USBO1_CTRL.EN
USBO1_ID: Q600.3(D) R607.2 ; harness USBO1_CTRL.ID
USBO1_OC#: IC601.8(OC_1#) R605.1 ; harness USBO1_CTRL.OC#
USBO1_SSRX_N: D605.2(D-) X603.5(SSRX-) ; port USBO1.SSRX_N
USBO1_SSRX_P: D605.1(D+) X603.6(SSRX+) ; port USBO1.SSRX_P
USBO1_SSTX_N: D606.1(D+) X603.8(SSTX-) ; port USBO1.SSTX_N
USBO1_SSTX_P: D606.2(D-) X603.9(SSTX+) ; port USBO1.SSTX_P
USBO1_VBUS: R604.1 ; harness USBO1_CTRL.VBUS
NetC600_2: C600.2 C601.1 IC600.7(OUT_1) L602.1
NetC603_2: C603.2 C604.1 IC600.6(OUT_2) L603.1
NetC606_2: C606.2 C607.1 IC601.7(OUT_1) L607.1
NetJ600_A5: J600.A5(CC1) R609.2
NetJ600_B5: J600.B5(CC2) R610.2
NetQ600_5: Q600.5(G) Q600.6(D) R606.1

Not connected (* = marked no-connect by the designer): IC601 5(OC_2#)* 6(OUT_2)*; J600 A2(TX1+)* A3(TX1-)* A8(SBU1)* A10(RX2-)* A11(RX2+)* B2(TX2+)* B3(TX2-)* B8(SBU2)* B10(RX1-)* B11(RX1+)*

### Layout directives
differential pair: USBH2_D_N, USBH2_D_P, USBH3_D_N, USBH3_D_P, USBH4_D_CON_N, USBH4_D_CON_P, USBH_D_CON_N, USBH_D_CON_P, USBH_D_FILT_N, USBH_D_FILT_P, USBO1_D_CON_N, USBO1_D_CON_P
net class USBO1_HS: (no net found under the mark)
net class USBH4_HS: (no net found under the mark)
net class USBH_D_HS: USBH_D_FILT_N, USBH_D_FILT_P

### Notes on the sheet
- USB 2.0 Connector
- Internal
- USB S.S. Connector
- Note
- This design is a modified version of the Toradex Ixora carrier board.
- Visit
- Compatible Apalis Modules can be bought from the
- Toradex Developer Resouces <https://developer.toradex.com/products/ixora-carrier-board>
- for the original Altium Project.
- Toradex Shop. <https://www.toradex.com/order-now/apalis-arm-family>
- Project:
- Size:
- Sheet:
- Title:
- A3
- of
- Drawn by:
- Revision:
- Date:
- Variant:
- b
- File:
- (in symbol C-TA-100uF-10V-10%-6032) +

### Library data of the parts
C600 C603 C606 = C-X7R-100nF-16V-10%-0402: Capacitor Ceramic X7R 100nF 16V 10% 0603; Tolerance: 10%; Type: X7R; Value: 100nF
C601 C604 C607 = C-TA-100uF-10V-10%-6032: Capacitor TA 100uF 10V 10% 6032; Tolerance: 10%; Type: TA; Value: 100uF
C602 C605 C608 = C-X7R-1nF-50V-10%-0402: Capacitor Ceramic X7R 1nF 50V 10% 0603; Tolerance: 10%; Type: X7R; Value: 1nF
D600-D606 = D-TI-TPD2EUSB30DRTR: 2 Channel Protection for Super Speed USB3.0; Manufacturer Name: TI; Manufacturer Part No.: TPD2EUSB30DRTR
IC600 IC601 = IC-TI-TPS2052BD: Dual High Side Switch With OC_DET 500mA/CH; Manufacturer Name: Texas Instruments; Manufacturer Part No.: TPS2052BD
J600 = Connector USB C: USB Type C Jack; Manufacturer Part No.: UJ31-CH-G1-SMT-TR
L600 L604 L606 = L-Murata-DLW21SN900SQ2-90R@100MHz-330mA-25%: Common Mode Choke High Speed 90R 330mA; Manufacturer Name: Murata; Tolerance: 25%; Rating: 330mA; Manufacturer Part No.: DLW21SN900SQ2; Value: 90R@100MHz
L601-L603 L605 L607-L609 = L-220R@100MHz-2A-25%-0603: 220R@100MHz 2A EMI FILTER; Tolerance: 25%; Rating: 2A; Value: 220R@100MHz
Q600 = Transistor N/PMOS Dual: Transistor Dual, NMOS & PMOS; Manufacturer Part No.: SQ1539EH-T1_GE3
R600-R603 = R-0R-63mW-1%-0603: Resistor 0 ohm 63mW 1% 0603; Rating: 63mW; Tolerance: 1%; Value: 0R
R604 = R-0R-63mW-1%-0402: Resistor 0 ohm 63mW 1% 0603; Rating: 63mW; Tolerance: 1%; Value: 0R
R605 = R-100KR-63mW-5%-0402: as R1401 on sheet Extension; Rating: 63mW; Tolerance: 5%
R606-R610 = Resistor
X600 = CON-Fci-73725-0110BLF: USB Type A Connector; Manufacturer Name: FCI; No. of ways: 4; System: Connector
X601 = CON-TE-1734366-3: USB Type A Connector Vertical; Manufacturer Name: TE; Manufacturer Part No.: 1734366-3; System: Connector
X602 = CON-Amphenol-GSB4116341HR: USB 3.1, Type A, sideways; System: Connector; Manufacturer Name: Amphenol; Manufacturer Part No.: GSB4116341HR
X603 = CON-Amphenol-GSB412137CHR: USB 3.1, Type A, vertical; System: Connector; Manufacturer Name: Amphenol; Manufacturer Part No.: GSB412137CHR

## Sheet USB.SchDoc
size A3; PageSetup: Record=PageOptions|CenterHorizontal=True|CenterVertical=True|PrintScale=0.73|XCorrection=1.00|YCorrection=1.00|PrintKind=0|BorderSize=5000000|LeftOffset=0|BottomOffset=0|Orientation=2|PaperLength=1000|PaperWidth=1000|Scale=100|PaperSource=7|PrintQuality=-4|MediaType=1|DitherType=10|PaperKind=A4|PrintScaleMode=1; Date: 27.05.2014; DrawnBy: luths8; Organization: BFH; Address1: Bern University of Applied Sciences; Address2: Engineering and Information Technology; Address3: Jlcoweg 1; Address4: CH-3400 Burgdorf; DocumentNumber: 5; Revision: 1.1; SheetNumber: 5; SheetTotal: 16; CurrentDate: 27.05.2014
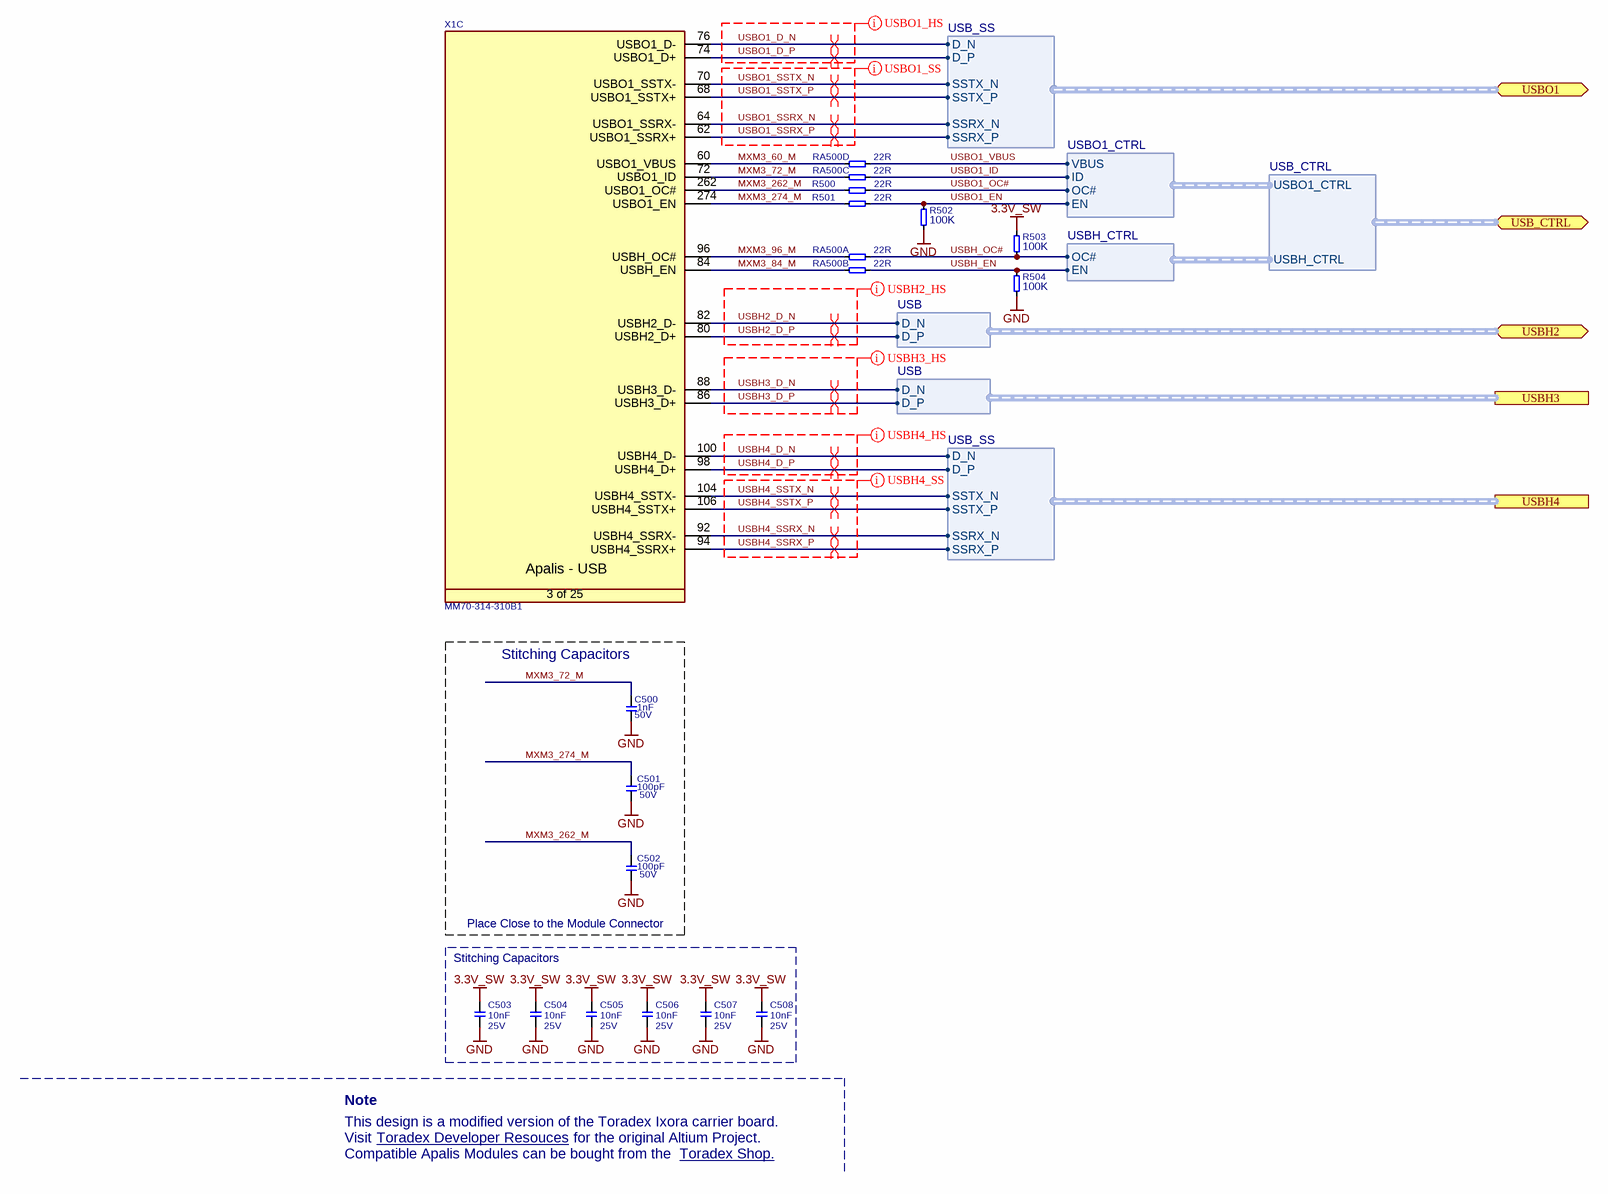
[diagram p11: USB.SchDoc]

### Parts
C500  Rating: 50V  [SMD0603CAP]  (hidden comment: 1nF)
C501  Rating: 50V  [SMD0603CAP]  (hidden comment: 100pF)
C502  Rating: 50V  [SMD0603CAP]  (hidden comment: 100pF)
C503  10nF  Rating: 25V  [SMD0603CAP]
C504  10nF  Rating: 25V  [SMD0603CAP]
C505  10nF  Rating: 25V  [SMD0603CAP]
C506  10nF  Rating: 25V  [SMD0603CAP]
C507  10nF  Rating: 25V  [SMD0603CAP]
C508  10nF  Rating: 25V  [SMD0603CAP]
R500  22R  [SMD0603RES]
R501  22R  [SMD0603RES]
R502  100K  [SMD0603RES]
R503  100K  [SMD0603RES]
R504  100K  [SMD0603RES]
RA500  22R  [T_Resistor_Array_X4]  (parts A,B,C,D of 4)
X1  Manufacturer Part No.: MM70-314-310B1  [T_JAE_MM70-314-310B1]  (hidden comment: CON-JAE-MM70-314-310B1-314-0.5mm)  (part C of 25)

### Blocks framed on the sheet
Stitching Capacitors: C500-C502

### Ports
USB_CTRL (bidir, harness USB_CTRL), USBH2 (bidir, harness USB), USBH3 (harness USB), USBH4 (harness USB_SS), USBO1 (bidir, harness USB_SS)

### Harnesses
USB_SS: D_N, D_P, SSTX_N, SSTX_P, SSRX_N, SSRX_P
USB: D_N, D_P
USBO1_CTRL: VBUS, ID, OC#, EN
USBH_CTRL: OC#, EN
USB_CTRL: USBO1_CTRL, USBH_CTRL

### Nets
3.3V_SW: C503.2 C504.2 C505.2 C506.2 C507.2 C508.2 R503.1
GND: C500.1 C501.1 C502.1 C503.1 C504.1 C505.1 C506.1 C507.1 C508.1 R502.1 R504.1
MXM3_60_M: RA500.1 X1.60(USBO1_VBUS)
MXM3_72_M: C500.2 RA500.2 X1.72(USBO1_ID)
MXM3_84_M: RA500.3 X1.84(USBH_EN)
MXM3_96_M: RA500.4 X1.96(USBH_OC#)
MXM3_262_M: C502.2 R500.1 X1.262(USBO1_OC#)
MXM3_274_M: C501.2 R501.1 X1.274(USBO1_EN)
USBH2_D_N: X1.82(USBH2_D-) ; port USBH2.D_N
USBH2_D_P: X1.80(USBH2_D+) ; port USBH2.D_P
USBH3_D_N: X1.88(USBH3_D-) ; port USBH3.D_N
USBH3_D_P: X1.86(USBH3_D+) ; port USBH3.D_P
USBH4_D_N: X1.100(USBH4_D-) ; port USBH4.D_N
USBH4_D_P: X1.98(USBH4_D+) ; port USBH4.D_P
USBH4_SSRX_N: X1.92(USBH4_SSRX-) ; port USBH4.SSRX_N
USBH4_SSRX_P: X1.94(USBH4_SSRX+) ; port USBH4.SSRX_P
USBH4_SSTX_N: X1.104(USBH4_SSTX-) ; port USBH4.SSTX_N
USBH4_SSTX_P: X1.106(USBH4_SSTX+) ; port USBH4.SSTX_P
USBH_EN: R504.2 RA500.7 ; harness USBH_CTRL.EN
USBH_OC#: R503.2 RA500.8 ; harness USBH_CTRL.OC#
USBO1_D_N: X1.76(USBO1_D-) ; port USBO1.D_N
USBO1_D_P: X1.74(USBO1_D+) ; port USBO1.D_P
USBO1_EN: R501.2 R502.2 ; harness USBO1_CTRL.EN
USBO1_ID: RA500.6 ; harness USBO1_CTRL.ID
USBO1_OC#: R500.2 ; harness USBO1_CTRL.OC#
USBO1_SSRX_N: X1.64(USBO1_SSRX-) ; port USBO1.SSRX_N
USBO1_SSRX_P: X1.62(USBO1_SSRX+) ; port USBO1.SSRX_P
USBO1_SSTX_N: X1.70(USBO1_SSTX-) ; port USBO1.SSTX_N
USBO1_SSTX_P: X1.68(USBO1_SSTX+) ; port USBO1.SSTX_P
USBO1_VBUS: RA500.5 ; harness USBO1_CTRL.VBUS

### Layout directives
differential pair: USBH2_D_N, USBH2_D_P, USBH3_D_N, USBH3_D_P, USBH4_D_N, USBH4_D_P, USBH4_SSRX_N, USBH4_SSRX_P, USBH4_SSTX_N, USBH4_SSTX_P, USBO1_D_N, USBO1_D_P, USBO1_SSRX_N, USBO1_SSRX_P, USBO1_SSTX_N, USBO1_SSTX_P
net class USBO1_SS: USBO1_SSRX_N, USBO1_SSRX_P, USBO1_SSTX_N, USBO1_SSTX_P
net class USBO1_HS: USBO1_D_N, USBO1_D_P
net class USBH2_HS: USBH2_D_N, USBH2_D_P
net class USBH3_HS: USBH3_D_N, USBH3_D_P
net class USBH4_SS: USBH4_SSRX_N, USBH4_SSRX_P, USBH4_SSTX_N, USBH4_SSTX_P
net class USBH4_HS: USBH4_D_N, USBH4_D_P

### Notes on the sheet
- (near C502) Place Close to the Module Connector
- Stitching Capacitors
- Note
- This design is a modified version of the Toradex Ixora carrier board.
- Visit
- Compatible Apalis Modules can be bought from the
- Toradex Developer Resouces <https://developer.toradex.com/products/ixora-carrier-board>
- for the original Altium Project.
- Toradex Shop. <https://www.toradex.com/order-now/apalis-arm-family>
- Project:
- Size:
- Sheet:
- Title:
- A3
- of
- Drawn by:
- Revision:
- Date:
- Variant:
- b
- File:
- (in symbol CON-JAE-MM70-314-310B1-314-0.5mm, part C) Apalis - USB; 3 of 25

### Library data of the parts
C500 = C-X7R-1nF-50V-10%-0402: Capacitor Ceramic X7R 1nF 50V 10% 0603; Tolerance: 10%; Type: X7R; Value: 1nF
C501 C502 = C-X7R-100pF-50V-10%-0402: Capacitor Ceramic X7R 100pF 50V 10% 0603; Tolerance: 10%; Type: X7R; Value: 100pF
C503-C508 = C-X7R-10nF-25V-10%-0603: Capacitor Ceramic X7R 10nF 25V 10% 0603; Tolerance: 10%; Type: X7R; Value: 10nF
R500 R501 = R-22R-63mW-5%-0402: Resistor 22 ohm 63mW 5% 0603; Rating: 63mW; Tolerance: 5%; Value: 22R
R502-R504 = R-100KR-63mW-5%-0402: as R1401 on sheet Extension; Rating: 63mW; Tolerance: 5%
RA500 = RA-22R-63mW-5%-1206-div: Resistor Array 22 R 63mW 5% 1206; Tolerance: 5%; Power Dissipation: 63mW; Value: 22R
X1 = CON-JAE-MM70-314-310B1-314-0.5mm: as X1 on sheet Extension

## Sheet HDMI.SchDoc
size A3; PageSetup: Record=PageOptions|CenterHorizontal=True|CenterVertical=True|PrintScale=0.73|XCorrection=1.00|YCorrection=1.00|PrintKind=0|BorderSize=5000000|LeftOffset=0|BottomOffset=0|Orientation=2|PaperLength=1000|PaperWidth=1000|Scale=100|PaperSource=7|PrintQuality=-4|MediaType=1|DitherType=10|PaperKind=A4|PrintScaleMode=1; Date: 27.05.2014; DrawnBy: luths8; Organization: BFH; Address1: Bern University of Applied Sciences; Address2: Engineering and Information Technology; Address3: Jlcoweg 1; Address4: CH-3400 Burgdorf; DocumentNumber: 10; Revision: 1.1; SheetNumber: 10; SheetTotal: 16; CurrentDate: 27.05.2014
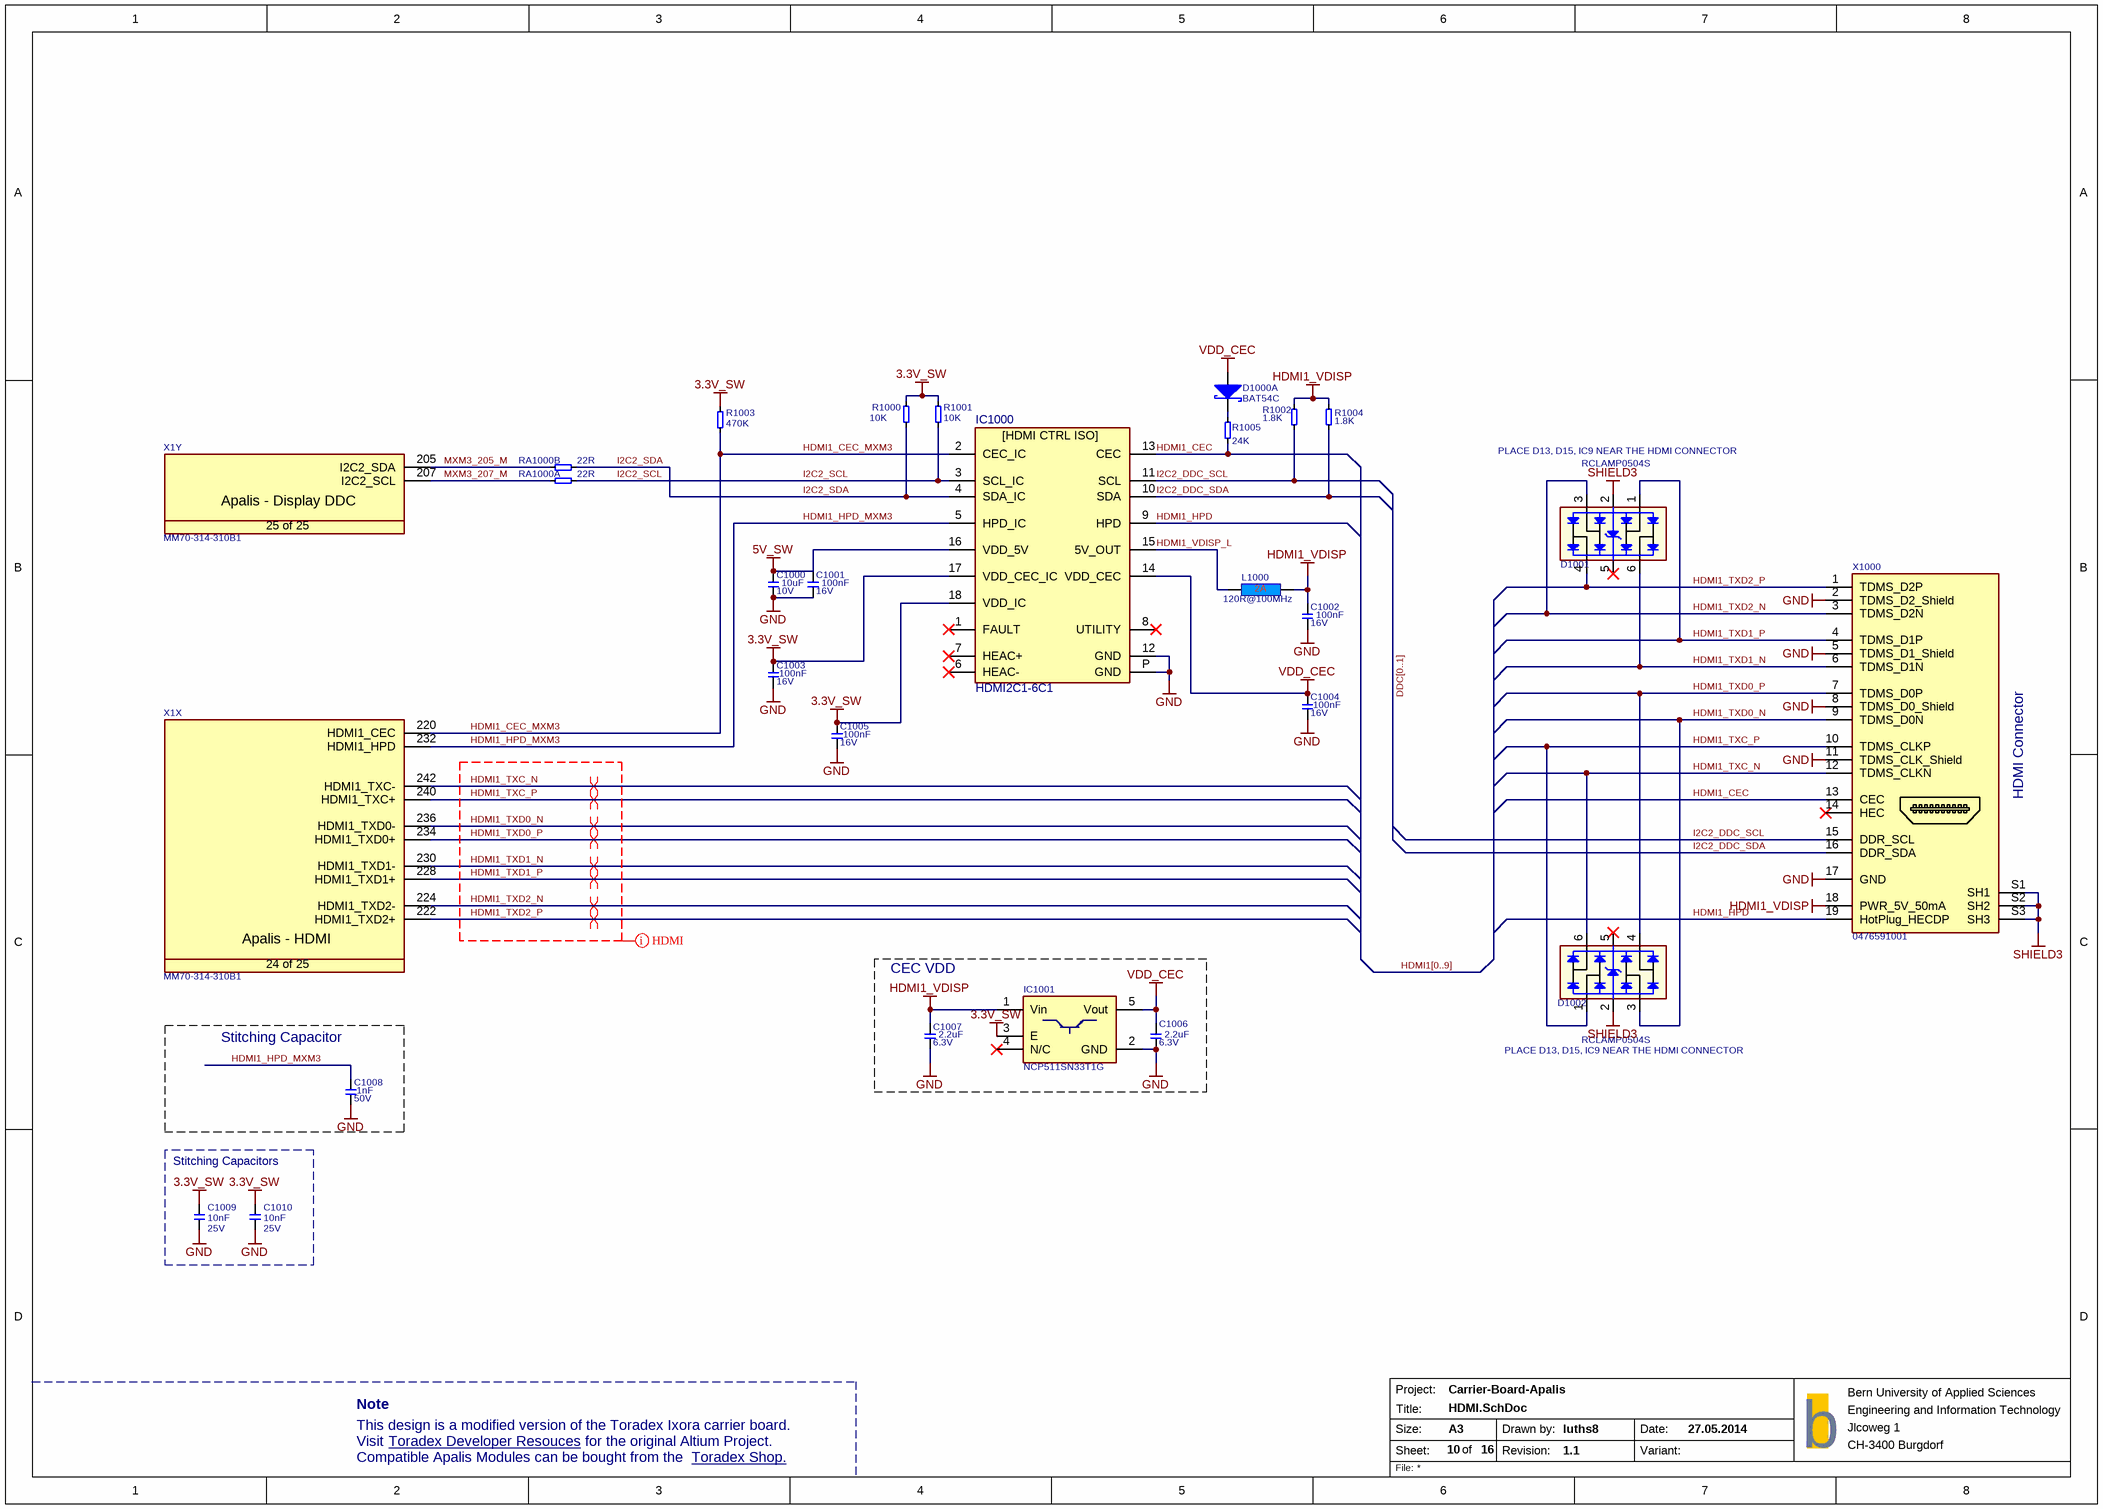
[diagram p12: HDMI.SchDoc]

### Parts
C1000  Rating: 10V  [SMD0603CAP]  (hidden comment: 10uF)
C1001  Rating: 16V  [SMD0603CAP]  (hidden comment: 100nF)
C1002  Rating: 16V  [SMD0603CAP]  (hidden comment: 100nF)
C1003  Rating: 16V  [SMD0603CAP]  (hidden comment: 100nF)
C1004  Rating: 16V  [SMD0603CAP]  (hidden comment: 100nF)
C1005  Rating: 16V  [SMD0603CAP]  (hidden comment: 100nF)
C1006  Rating: 6.3V  [SMD0603CAP]  (hidden comment: 2.2uF)
C1007  Rating: 6.3V  [SMD0603CAP]  (hidden comment: 2.2uF)
C1008  Rating: 50V  [SMD0603CAP]  (hidden comment: 1nF)
C1009  10nF  Rating: 25V  [SMD0603CAP]
C1010  10nF  Rating: 25V  [SMD0603CAP]
D1000  BAT54C  [SOT95P230X110-3N]  (part A of 2)
D1001  RCLAMP0504S  [T_SOT95P285X90-6N]
D1002  RCLAMP0504S  [T_SOT95P285X90-6N]
IC1000  HDMI2C1-6C1  [QFN18]
IC1001  NCP511SN33T1G  [SOT95P279X142-5N]
L1000  120R@100MHz  [INDC1608X95N]
R1000  10K  [SMD0603RES]
R1001  10K  [SMD0603RES]
R1002  1.8K  [SMD0603RES]
R1003  470K  [SMD0603RES]
R1004  1.8K  [SMD0603RES]
R1005  24K  [SMD0603RES]
RA1000  22R  [T_Resistor_Array_X4]  (parts A,B of 4)
X1  Manufacturer Part No.: MM70-314-310B1  [T_JAE_MM70-314-310B1]  (hidden comment: CON-JAE-MM70-314-310B1-314-0.5mm)  (parts X,Y of 25)
X1000  0476591001  [0476591001]

### Blocks framed on the sheet
CEC VDD: C1006 C1007 IC1001
Stitching Capacitor: C1008
Stitching Capacitors: C1009 C1010

### Nets
3.3V_SW: C1003.2 C1005.2 C1009.2 C1010.2 IC1000.17(VDD_CEC_IC) IC1000.18(VDD_IC) IC1001.3(E) R1000.2 R1001.2 R1003.2
5V_SW: C1000.2 C1001.1 IC1000.16(VDD_5V)
GND: C1000.1 C1001.2 C1002.1 C1003.1 C1004.1 C1005.1 C1006.1 C1007.1 C1008.1 C1009.1 C1010.1 IC1000.12(GND) IC1000.P(GND) IC1001.2(GND) X1000.2(TDMS_D2_Shield) X1000.5(TDMS_D1_Shield) X1000.8(TDMS_D0_Shield) X1000.11(TDMS_CLK_Shield) X1000.17(GND)
HDMI1_VDISP: C1002.2 C1007.2 IC1001.1(Vin) L1000.2 R1002.2 R1004.2 X1000.18(PWR_5V_50mA)
SHIELD3: D1001.2 D1002.2 X1000.S1(SH1) X1000.S2(SH2) X1000.S3(SH3)
VDD_CEC: C1004.2 C1006.2 D1000.1 IC1000.14(VDD_CEC) IC1001.5(Vout)
HDMI1_CEC: IC1000.13(CEC) R1005.1 X1000.13(CEC)
HDMI1_CEC_MXM3: IC1000.2(CEC_IC) R1003.1 X1.220(HDMI1_CEC)
HDMI1_HPD: IC1000.9(HPD) X1000.19(HotPlug_HECDP)
HDMI1_HPD_MXM3: C1008.2 IC1000.5(HPD_IC) X1.232(HDMI1_HPD)
HDMI1_TXC_N: D1002.6 X1.242(HDMI1_TXC-) X1000.12(TDMS_CLKN)
HDMI1_TXC_P: D1002.1 X1.240(HDMI1_TXC+) X1000.10(TDMS_CLKP)
HDMI1_TXD0_N: D1002.3 X1.236(HDMI1_TXD0-) X1000.9(TDMS_D0N)
HDMI1_TXD0_P: D1002.4 X1.234(HDMI1_TXD0+) X1000.7(TDMS_D0P)
HDMI1_TXD1_N: D1001.6 X1.230(HDMI1_TXD1-) X1000.6(TDMS_D1N)
HDMI1_TXD1_P: D1001.1 X1.228(HDMI1_TXD1+) X1000.4(TDMS_D1P)
HDMI1_TXD2_N: D1001.3 X1.224(HDMI1_TXD2-) X1000.3(TDMS_D2N)
HDMI1_TXD2_P: D1001.4 X1.222(HDMI1_TXD2+) X1000.1(TDMS_D2P)
HDMI1_VDISP_L: IC1000.15(5V_OUT) L1000.1
I2C2_DDC_SCL: IC1000.11(SCL) R1002.1 X1000.15(DDR_SCL)
I2C2_DDC_SDA: IC1000.10(SDA) R1004.1 X1000.16(DDR_SDA)
I2C2_SCL: IC1000.3(SCL_IC) R1001.1 RA1000.5
I2C2_SDA: IC1000.4(SDA_IC) R1000.1 RA1000.6
MXM3_205_M: RA1000.2 X1.205(I2C2_SDA)
MXM3_207_M: RA1000.1 X1.207(I2C2_SCL)
NetD1000_3: D1000.3 R1005.2

Not connected (* = marked no-connect by the designer): D1001 5*; D1002 5*; IC1000 1(FAULT)* 6(HEAC-)* 7(HEAC+)* 8(UTILITY)*; IC1001 4(N/C)*; X1000 14(HEC)*

### Buses and harness runs
bus DDC[0..1]
bus HDMI1[0..9]

### Layout directives
differential pair: HDMI1_TXC_N, HDMI1_TXC_P, HDMI1_TXD0_N, HDMI1_TXD0_P, HDMI1_TXD1_N, HDMI1_TXD1_P, HDMI1_TXD2_N, HDMI1_TXD2_P
net class HDMI: HDMI1_TXC_N, HDMI1_TXC_P, HDMI1_TXD0_N, HDMI1_TXD0_P, HDMI1_TXD1_N, HDMI1_TXD1_P, HDMI1_TXD2_N, HDMI1_TXD2_P

### Notes on the sheet
- (near D1001) PLACE D13, D15, IC9 NEAR THE HDMI CONNECTOR
- (near X1000) HDMI Connector
- (near D1002) PLACE D13, D15, IC9 NEAR THE HDMI CONNECTOR
- Note
- This design is a modified version of the Toradex Ixora carrier board.
- Visit
- Compatible Apalis Modules can be bought from the
- Toradex Developer Resouces <https://developer.toradex.com/products/ixora-carrier-board>
- for the original Altium Project.
- Toradex Shop. <https://www.toradex.com/order-now/apalis-arm-family>
- Project:
- Size:
- Sheet:
- Title:
- A3
- of
- Drawn by:
- Revision:
- Date:
- Variant:
- b
- File:
- (in symbol CON-JAE-MM70-314-310B1-314-0.5mm, part X) Apalis - HDMI; 24 of 25
- (in symbol CON-JAE-MM70-314-310B1-314-0.5mm, part Y) Apalis - Display DDC; 25 of 25
- (in symbol HDMI2C1-6C1) [HDMI CTRL ISO]

### Library data of the parts
C1000 = C-X5R-10uF-10V-20%-0603: Capacitor Ceramic X5R 10uF 10V 20% 0603; Tolerance: 20%; Type: X5R; Value: 10uF
C1001-C1005 = C-X7R-100nF-16V-10%-0402: Capacitor Ceramic X7R 100nF 16V 10% 0603; Tolerance: 10%; Type: X7R; Value: 100nF
C1006 C1007 = C-X5R-2.2uF-6.3V-20%-0603: Capacitor Ceramic X5R 2.2uF 6.3V 20% 0603; Tolerance: 20%; Type: X5R; Value: 2.2uF
C1008 = C-X7R-1nF-50V-10%-0402: Capacitor Ceramic X7R 1nF 50V 10% 0603; Tolerance: 10%; Type: X7R; Value: 1nF
C1009 C1010 = C-X7R-10nF-25V-10%-0603: Capacitor Ceramic X7R 10nF 25V 10% 0603; Tolerance: 10%; Type: X7R; Value: 10nF
D1000 = D-Philips-BAT54C-Schottky-30V-200mA: BAT54 Schottky Diode; Manufacturer: Philips; Manufacturer Part Number: BAT54C
D1001 D1002 = D-Semtech-RClamp0504S: TVS Array low cap; Manufacturer Name: Semtech; Manufacturer Part No.: RCLAMP0504S
IC1000 = HDMI2C1-6C1: HDMI ESD protection, level shifter and backdrive protection; Manufacturer Part No.: HDMI2C1-6C1
IC1001 = IC-ON-NCP511SN33T1G: NCP511SN33T1G LDO Regulator; Manufacturer Name: ON Semiconductor; Manufacturer Part No.: NCP511SN33T1G
L1000 = L-120R@100MHz-2A-25%-0603: 120R@100MHz 2A EMI FILTER; Tolerance: 25%; Rating: 2A; Value: 120R@100MHz
R1000 R1001 = R-10KR-63mW-1%-0603: Resistor 10 Kohm 63mW 1% 0603; Value: 10KR; Rating: 63mW; Tolerance: 1%
R1002 R1004 = R-1.8KR-63mW-5%-0603: Resistor 1.8 Kohm 63mW 5% 0603; Value: 1.8KR; Rating: 63mW; Tolerance: 5%
R1003 = R-470KR-63mW-5%-0402: Resistor 470 Kohm 63mW 5% 0603; Value: 470KR; Rating: 63mW; Tolerance: 5%
R1005 = R-24KR-63mW-1%-0402: Resistor 24 Kohm 63mW 1% 0603; Value: 24KR; Rating: 63mW; Tolerance: 1%
RA1000 = RA-22R-63mW-5%-1206-div: Resistor Array 22 R 63mW 5% 1206; Tolerance: 5%; Power Dissipation: 63mW; Value: 22R
X1 = CON-JAE-MM70-314-310B1-314-0.5mm: as X1 on sheet Extension
X1000 = CON-Molex-0476591001: HDMI Connector Vertical; Manufacturer: Molex; Manufacturer Part No.: 0476591001; System: Connector

## Sheet Miscellaneous.SchDoc
size A3; PageSetup: Record=PageOptions|CenterHorizontal=True|CenterVertical=True|PrintScale=0.71|XCorrection=1.00|YCorrection=1.00|PrintKind=0|BorderSize=5000000|LeftOffset=0|BottomOffset=0|Orientation=2|PaperLength=1000|PaperWidth=1000|Scale=100|PaperSource=7|PrintQuality=-4|MediaType=1|DitherType=10|PaperKind=A4|PrintScaleMode=1; Date: 27.05.2014; DrawnBy: luths8; Organization: BFH; Address1: Bern University of Applied Sciences; Address2: Engineering and Information Technology; Address3: Jlcoweg 1; Address4: CH-3400 Burgdorf; DocumentNumber: 15; Revision: 1.0; SheetNumber: 15; SheetTotal: 16; CurrentDate: 27.05.2014
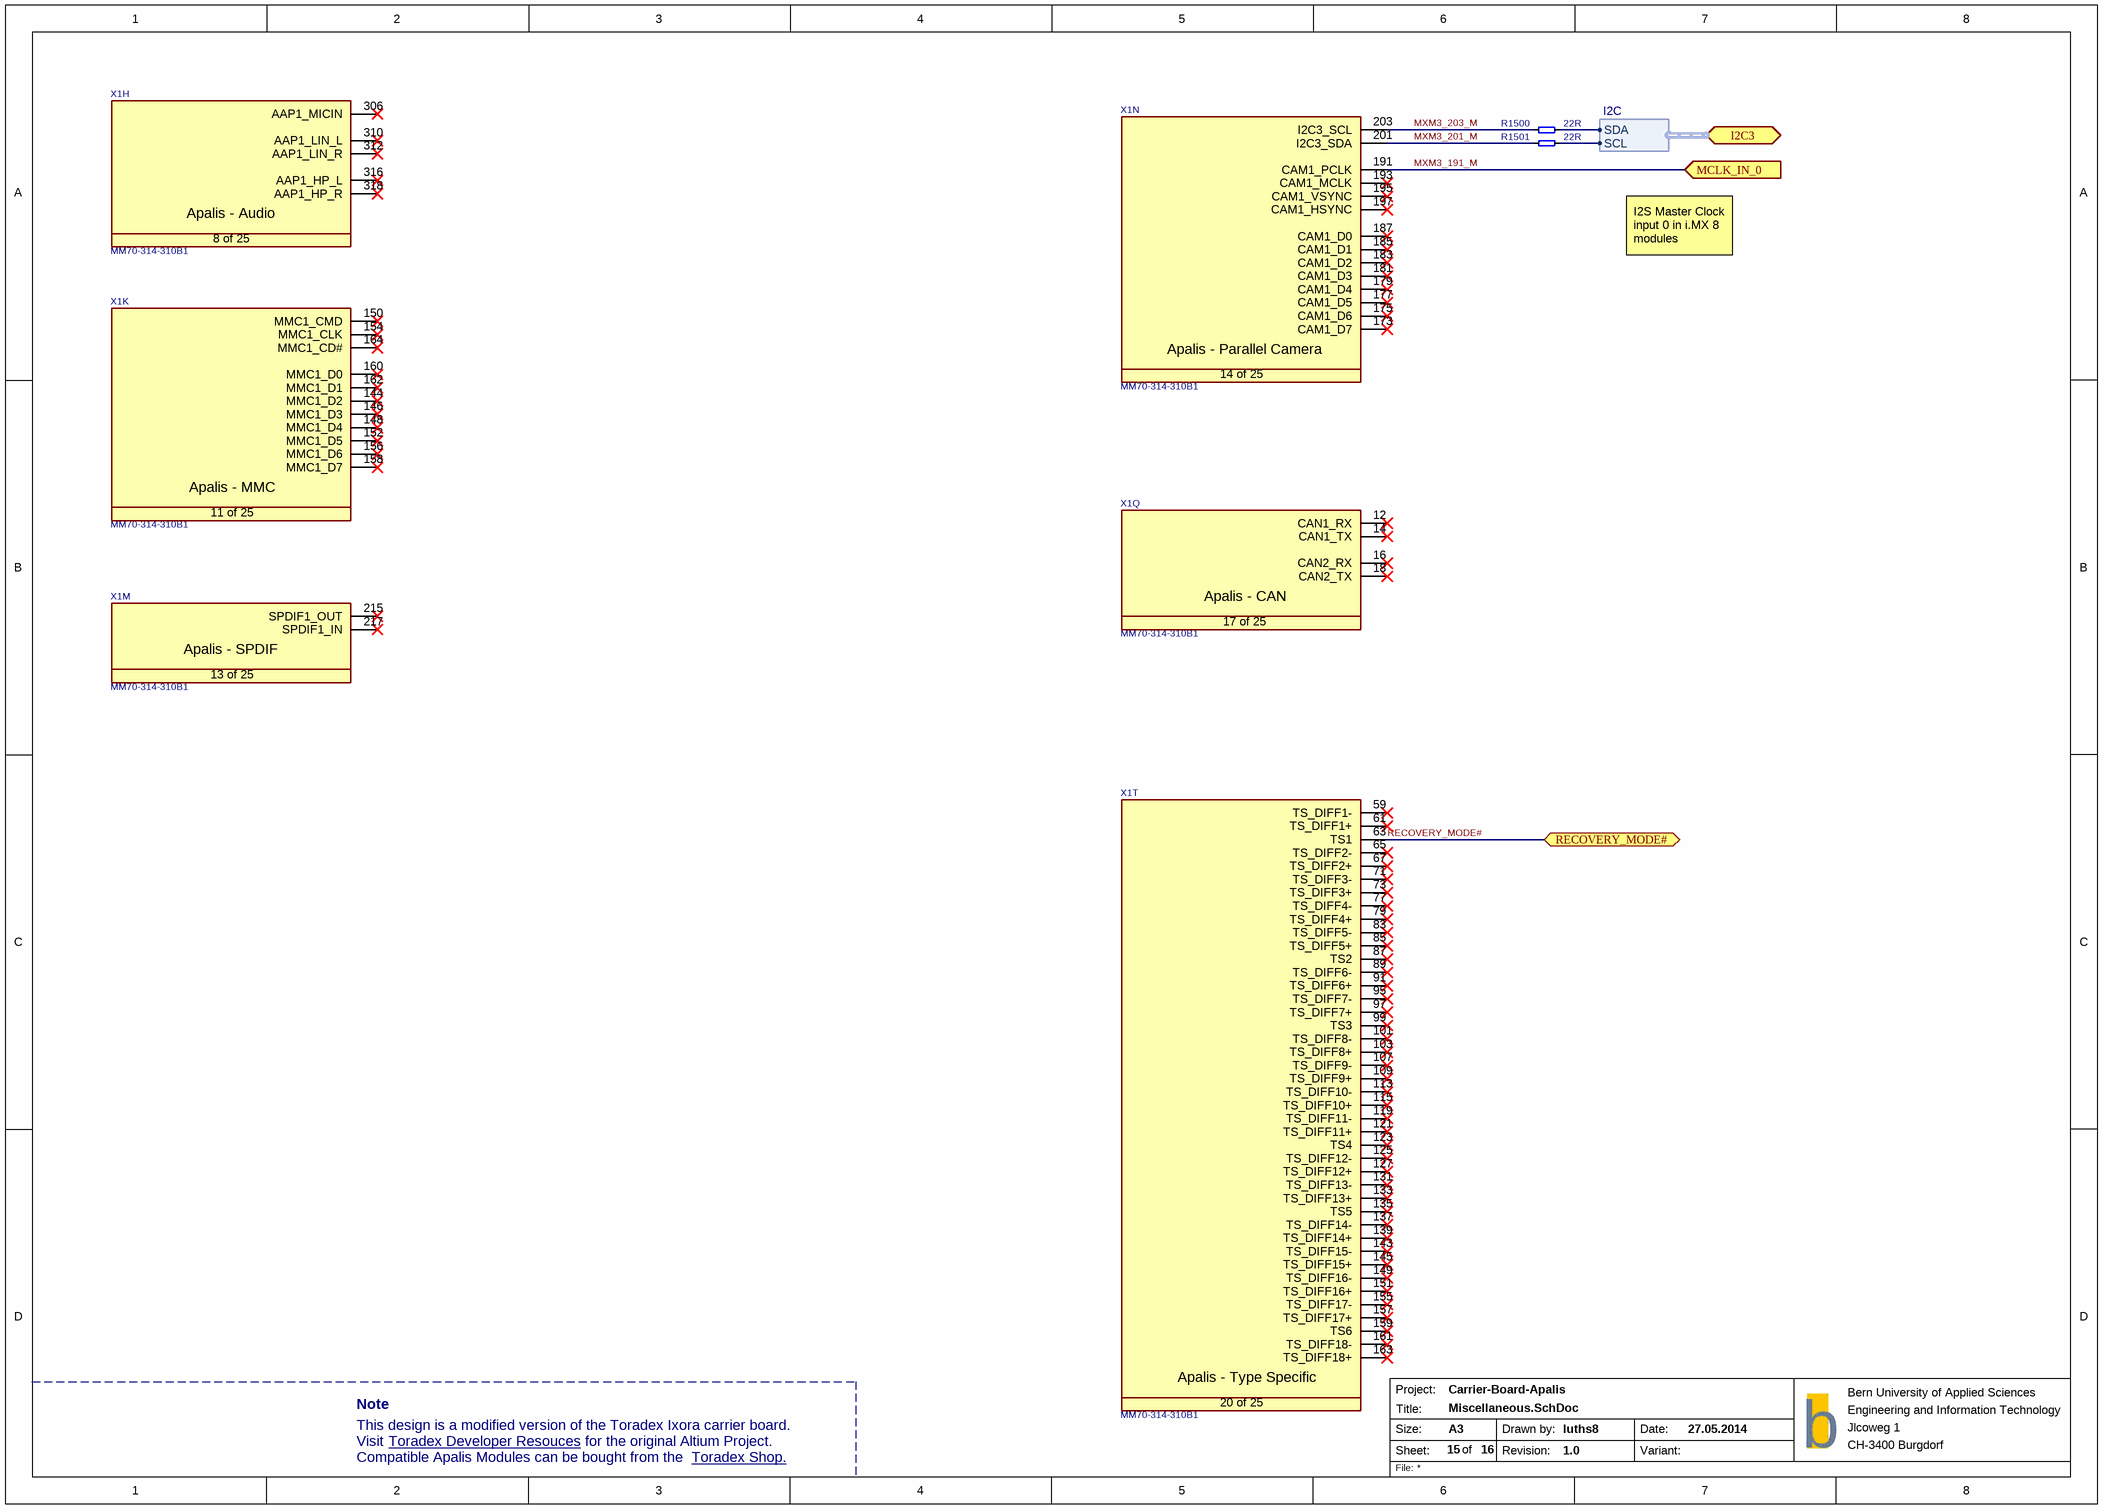
[diagram p13: Miscellaneous.SchDoc]

### Parts
R1500  22R  [SMD0603RES]
R1501  22R  [SMD0603RES]
X1  Manufacturer Part No.: MM70-314-310B1  [T_JAE_MM70-314-310B1]  (hidden comment: CON-JAE-MM70-314-310B1-314-0.5mm)  (parts H,K,M,N,Q,T of 25)

### Ports
I2C3 (bidir, harness I2C, see 12, 17, 19, 5), MCLK_IN_0 (in), RECOVERY_MODE# (bidir, see 19)

### Harnesses
I2C: SCL, SDA

### Nets
MXM3_191_M: X1.191(CAM1_PCLK) ; port MCLK_IN_0
MXM3_201_M: R1501.1 X1.201(I2C3_SDA)
MXM3_203_M: R1500.1 X1.203(I2C3_SCL)
RECOVERY_MODE#: X1.63(TS1) ; port RECOVERY_MODE#
NetR803_2: R1500.2 ; port I2C3.SDA
NetR804_2: R1501.2 ; port I2C3.SCL

Not connected (* = marked no-connect by the designer): X1 12(CAN1_RX)* 14(CAN1_TX)* 16(CAN2_RX)* 18(CAN2_TX)* 59(TS_DIFF1-)* 61(TS_DIFF1+)* 65(TS_DIFF2-)* 67(TS_DIFF2+)* 71(TS_DIFF3-)* 73(TS_DIFF3+)* 77(TS_DIFF4-)* 79(TS_DIFF4+)* 83(TS_DIFF5-)* 85(TS_DIFF5+)* 87(TS2)* 89(TS_DIFF6-)* 91(TS_DIFF6+)* 95(TS_DIFF7-)* 97(TS_DIFF7+)* 99(TS3)* 101(TS_DIFF8-)* 103(TS_DIFF8+)* 107(TS_DIFF9-)* 109(TS_DIFF9+)* 113(TS_DIFF10-)* 115(TS_DIFF10+)* 119(TS_DIFF11-)* 121(TS_DIFF11+)* 123(TS4)* 125(TS_DIFF12-)* 127(TS_DIFF12+)* 131(TS_DIFF13-)* 133(TS_DIFF13+)* 135(TS5)* 137(TS_DIFF14-)* 139(TS_DIFF14+)* 143(TS_DIFF15-)* 144(MMC1_D2)* 145(TS_DIFF15+)* 146(MMC1_D3)* 148(MMC1_D4)* 149(TS_DIFF16-)* 150(MMC1_CMD)* 151(TS_DIFF16+)* 152(MMC1_D5)* 154(MMC1_CLK)* 155(TS_DIFF17-)* 156(MMC1_D6)* 157(TS_DIFF17+)* 158(MMC1_D7)* 159(TS6)* 160(MMC1_D0)* 161(TS_DIFF18-)* 162(MMC1_D1)* 163(TS_DIFF18+)* 164(MMC1_CD#)* 173(CAM1_D7)* 175(CAM1_D6)* 177(CAM1_D5)* 179(CAM1_D4)* 181(CAM1_D3)* 183(CAM1_D2)* 185(CAM1_D1)* 187(CAM1_D0)* 193(CAM1_MCLK)* 195(CAM1_VSYNC)* 197(CAM1_HSYNC)* 215(SPDIF1_OUT)* 217(SPDIF1_IN)* 306(AAP1_MICIN)* 310(AAP1_LIN_L)* 312(AAP1_LIN_R)* 316(AAP1_HP_L)* 318(AAP1_HP_R)*

### Notes on the sheet
- I2S Master Clock input 0 in i.MX 8 modules
- Note
- This design is a modified version of the Toradex Ixora carrier board.
- Visit
- Compatible Apalis Modules can be bought from the
- Toradex Developer Resouces <https://developer.toradex.com/products/ixora-carrier-board>
- for the original Altium Project.
- Toradex Shop. <https://www.toradex.com/order-now/apalis-arm-family>
- Project:
- Size:
- Sheet:
- Title:
- A3
- of
- Drawn by:
- Revision:
- Date:
- Variant:
- b
- File:
- (in symbol CON-JAE-MM70-314-310B1-314-0.5mm, part H) Apalis - Audio; 8 of 25
- (in symbol CON-JAE-MM70-314-310B1-314-0.5mm, part K) Apalis - MMC; 11 of 25
- (in symbol CON-JAE-MM70-314-310B1-314-0.5mm, part M) Apalis - SPDIF; 13 of 25
- (in symbol CON-JAE-MM70-314-310B1-314-0.5mm, part N) Apalis - Parallel Camera; 14 of 25
- (in symbol CON-JAE-MM70-314-310B1-314-0.5mm, part Q) Apalis - CAN; 17 of 25
- (in symbol CON-JAE-MM70-314-310B1-314-0.5mm, part T) Apalis - Type Specific; 20 of 25

### Library data of the parts
R1500 R1501 = R-22R-63mW-5%-0402: Resistor 22 ohm 63mW 5% 0603; Rating: 63mW; Tolerance: 5%; Value: 22R
X1 = CON-JAE-MM70-314-310B1-314-0.5mm: as X1 on sheet Extension

## Sheet Audio.SchDoc
size A3; Date: 27.05.2014; DrawnBy: luths8; Organization: BFH; Address1: Bern University of Applied Sciences; Address2: Engineering and Information Technology; Address3: Jlcoweg 1; Address4: CH-3400 Burgdorf; DocumentNumber: 8; Revision: 1.0; SheetNumber: 8; SheetTotal: 16; CurrentDate: 27.05.2014
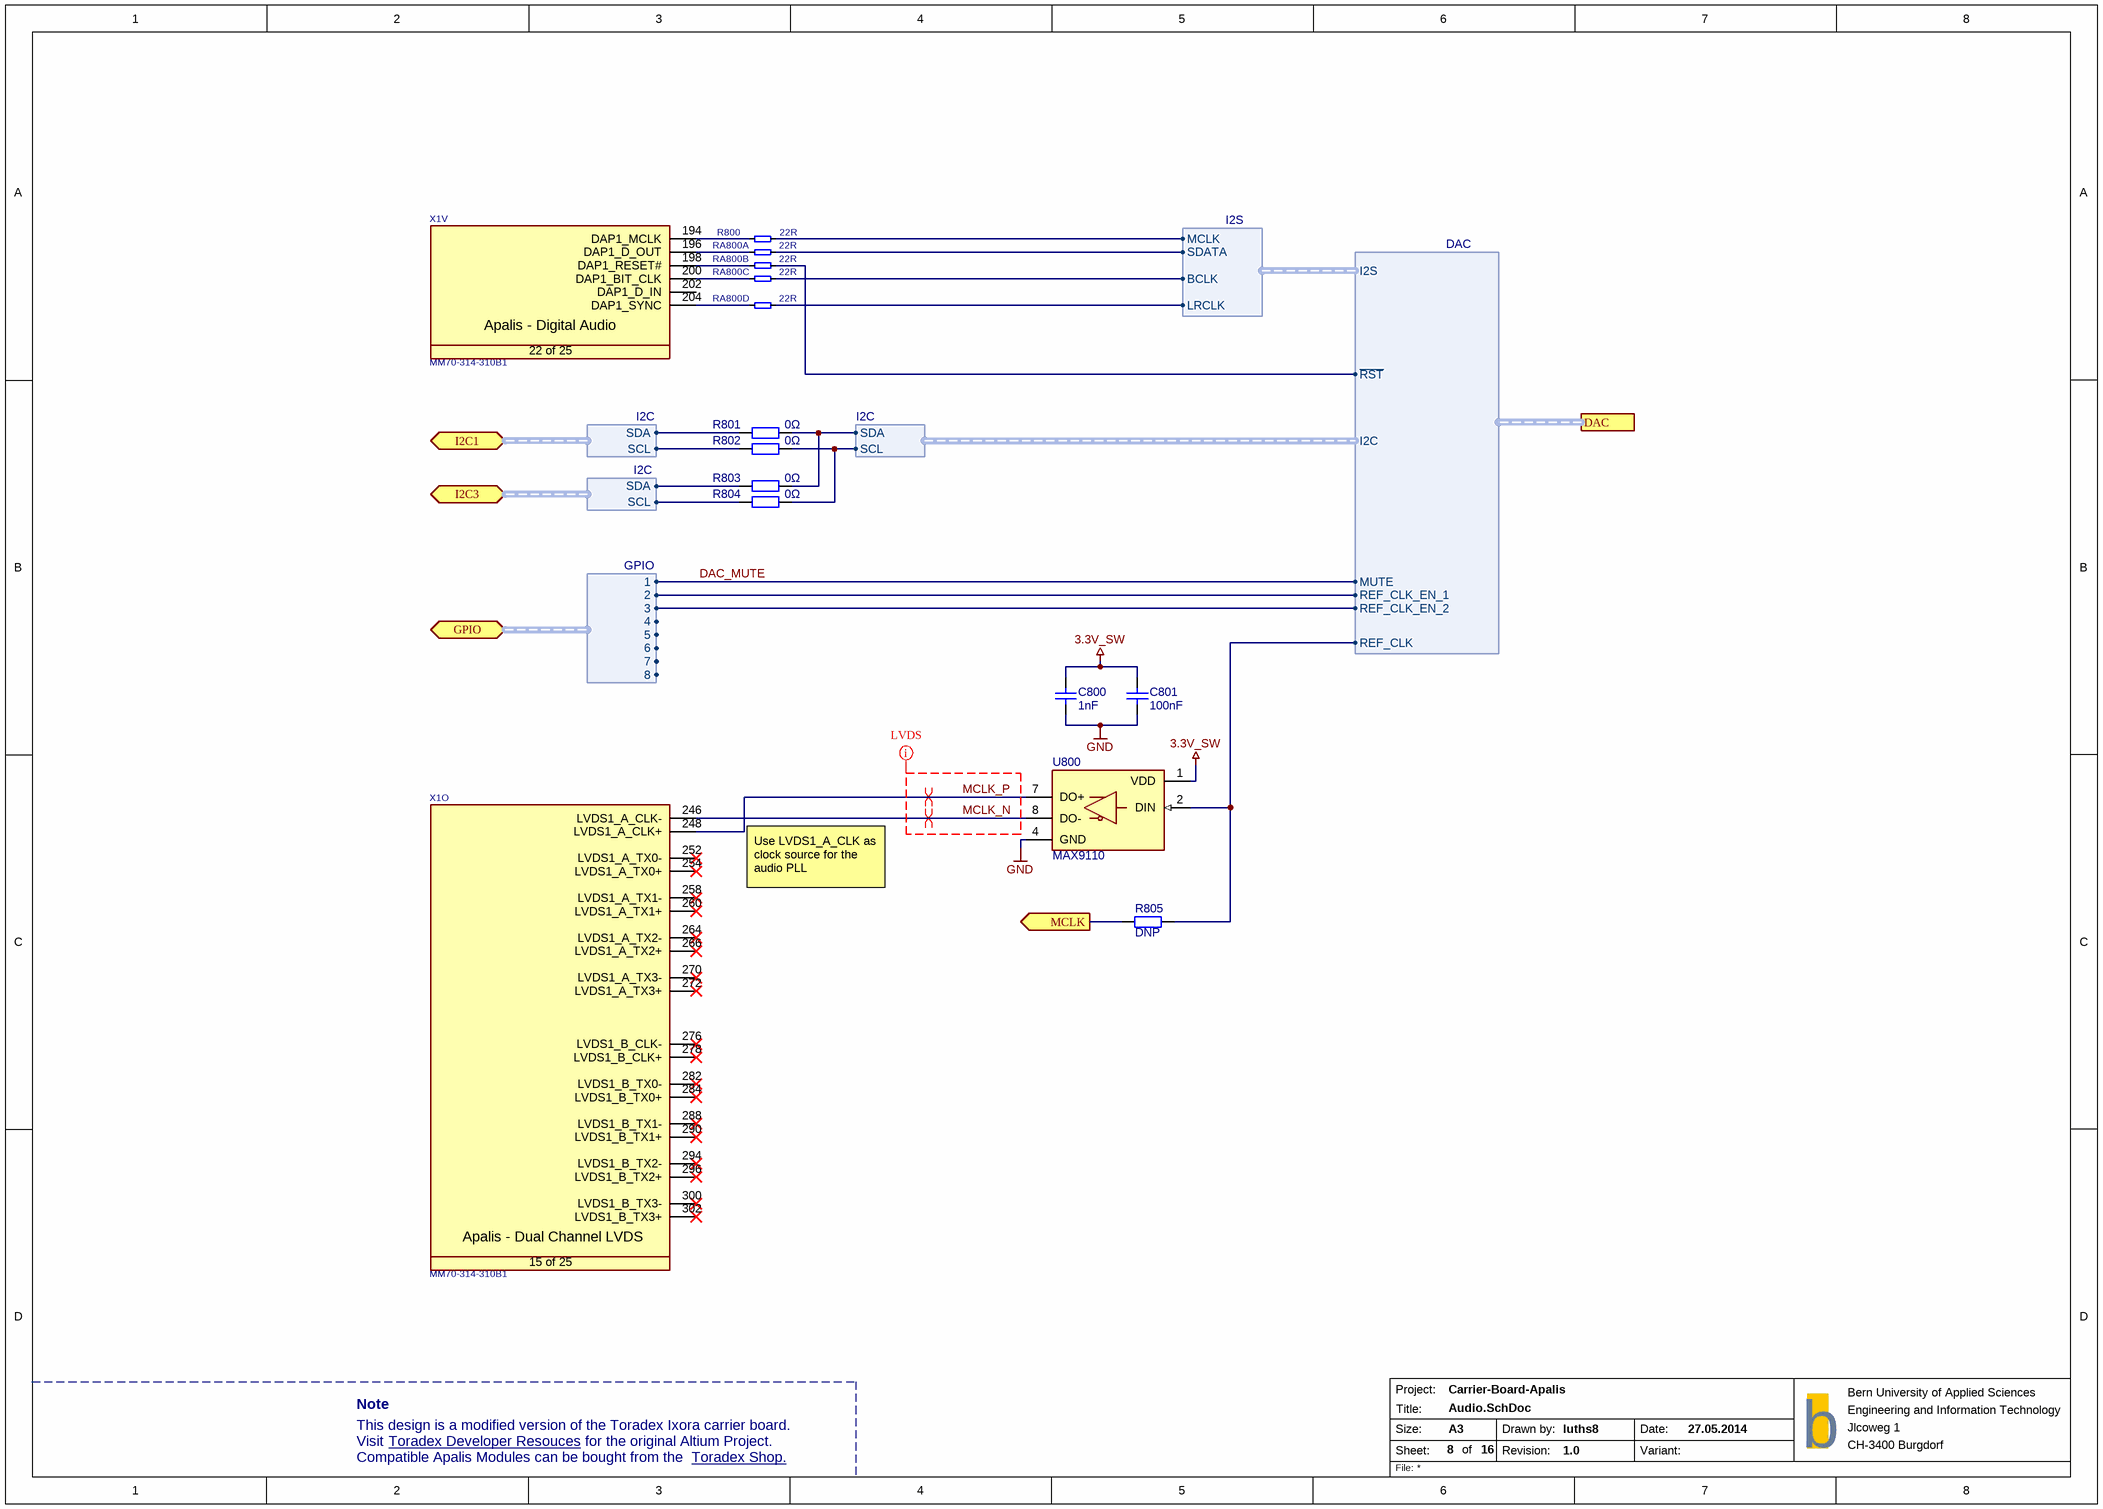
[diagram p14: Audio.SchDoc]

### Parts
C800  1nF  [SMD0603CAP]
C801  100nF  [SMD0603CAP]
R800  22R  [SMD0603RES]
R801  0Ω  [SMD0603RES]
R802  0Ω  [SMD0603RES]
R803  0Ω  [SMD0603RES]
R804  0Ω  [SMD0603RES]
R805  DNP  [SMD0603RES]
RA800  22R  [T_Resistor_Array_X4]  (parts A,B,C,D of 4)
U800  MAX9110  [SOIC8]
X1  Manufacturer Part No.: MM70-314-310B1  [T_JAE_MM70-314-310B1]  (hidden comment: CON-JAE-MM70-314-310B1-314-0.5mm)  (parts O,V of 25)

### Ports
DAC (harness DAC), GPIO (bidir, harness GPIO, see 12, 17, 19, 5), I2C1 (bidir, harness I2C, see 12, 17, 19, 5), I2C3 (bidir, harness I2C, see 12, 17, 19, 5), MCLK (out)

### Harnesses
I2S: MCLK, BCLK, LRCLK, SDATA
DAC: I2S, ~{RST}, I2C, MUTE, REF_CLK_EN_1, REF_CLK_EN_2, REF_CLK
I2C: SCL, SDA
GPIO: 1, 2, 3, 4, 5, 6, 7, 8

### Nets
3.3V_SW: C800.1 C801.1 U800.1(VDD)
GND: C800.2(q) C801.2(q) U800.4(GND)
~{DAC_RST}: RA800.6 ; port DAC.~{RST}
DAC_BCLK: RA800.7 ; harness I2S.BCLK
DAC_LRCLK: RA800.8 ; harness I2S.LRCLK
DAC_MCLK: R800.2 ; harness I2S.MCLK
DAC_MUTE: port DAC.MUTE, port GPIO.1
DAC_SCL_SCLK: R802.1 R804.1 ; harness I2C.SCL
DAC_SDA_MOSI: R801.1 R803.1 ; harness I2C.SDA
DAC_SDATA: RA800.5 ; harness I2S.SDATA
I2C1_SCL: R802.2 ; port I2C1.SCL
I2C1_SDA: R801.2 ; port I2C1.SDA
MCLK_N: U800.8(DO-) X1.246(LVDS1_A_CLK-)
MCLK_P: U800.7(DO+) X1.248(LVDS1_A_CLK+)
MXM3_191_M: R805.2 ; port MCLK
REF_CLK: R805.1 U800.2(DIN) ; port DAC.REF_CLK
REF_CLK_EN_1: port DAC.REF_CLK_EN_1, port GPIO.2
REF_CLK_EN_2: port DAC.REF_CLK_EN_2, port GPIO.3
NetR800_1: R800.1 X1.194(DAP1_MCLK)
NetR803_2: R803.2 ; port I2C3.SDA
NetR804_2: R804.2 ; port I2C3.SCL
NetRA800_1: RA800.1 X1.196(DAP1_D_OUT)
NetRA800_2: RA800.2 X1.198(DAP1_RESET#)
NetRA800_3: RA800.3 X1.200(DAP1_BIT_CLK)
NetRA800_4: RA800.4 X1.204(DAP1_SYNC)

Not connected (* = marked no-connect by the designer): X1 202(DAP1_D_IN) 252(LVDS1_A_TX0-)* 254(LVDS1_A_TX0+)* 258(LVDS1_A_TX1-)* 260(LVDS1_A_TX1+)* 264(LVDS1_A_TX2-)* 266(LVDS1_A_TX2+)* 270(LVDS1_A_TX3-)* 272(LVDS1_A_TX3+)* 276(LVDS1_B_CLK-)* 278(LVDS1_B_CLK+)* 282(LVDS1_B_TX0-)* 284(LVDS1_B_TX0+)* 288(LVDS1_B_TX1-)* 290(LVDS1_B_TX1+)* 294(LVDS1_B_TX2-)* 296(LVDS1_B_TX2+)* 300(LVDS1_B_TX3-)* 302(LVDS1_B_TX3+)*

### Layout directives
differential pair: MCLK_N, MCLK_P
net class LVDS: MCLK_N, MCLK_P

### Notes on the sheet
- Use LVDS1_A_CLK as clock source for the audio PLL
- Note
- This design is a modified version of the Toradex Ixora carrier board.
- Visit
- Compatible Apalis Modules can be bought from the
- Toradex Developer Resouces <https://developer.toradex.com/products/ixora-carrier-board>
- for the original Altium Project.
- Toradex Shop. <https://www.toradex.com/order-now/apalis-arm-family>
- Project:
- Size:
- Sheet:
- Title:
- A3
- of
- Drawn by:
- Revision:
- Date:
- Variant:
- b
- File:
- (in symbol CON-JAE-MM70-314-310B1-314-0.5mm, part O) Apalis - Dual Channel LVDS; 15 of 25
- (in symbol CON-JAE-MM70-314-310B1-314-0.5mm, part V) Apalis - Digital Audio; 22 of 25
- (in symbol CON-JAE-MM70-314-310B1-314-0.5mm, part H) Apalis - Audio; 8 of 25
- (in symbol CON-JAE-MM70-314-310B1-314-0.5mm, part M) Apalis - SPDIF; 13 of 25

### Library data of the parts
C800 C801 = Capacitor Ceramic: Ceramic Capacitor; Voltage: *; Manufacturer Part No.: *
R800 = R-22R-63mW-5%-0402: Resistor 22 ohm 63mW 5% 0603; Rating: 63mW; Tolerance: 5%; Value: 22R
R801-R805 = Resistor: Manufacturer Part No.: *
RA800 = RA-22R-63mW-5%-1206-div: Resistor Array 22 R 63mW 5% 1206; Tolerance: 5%; Power Dissipation: 63mW; Value: 22R
U800 = MAX9110: LVDS Transmitter; Manufacturer Part No.: MAX9110ESA+
X1 = CON-JAE-MM70-314-310B1-314-0.5mm: as X1 on sheet Extension

## Sheet DAC_Interface.SchDoc
size A3; PageSetup: Record=PageOptions|CenterHorizontal=True|CenterVertical=True|PrintScale=0.71|XCorrection=1.00|YCorrection=1.00|PrintKind=0|BorderSize=5000000|LeftOffset=0|BottomOffset=0|Orientation=2|PaperLength=1000|PaperWidth=1000|Scale=100|PaperSource=7|PrintQuality=-4|MediaType=1|DitherType=10|PaperKind=A4|PrintScaleMode=1; Date: 27.05.2014; DrawnBy: luths8; Organization: BFH; Address1: Bern University of Applied Sciences; Address2: Engineering and Information Technology; Address3: Jlcoweg 1; Address4: CH-3400 Burgdorf; DocumentNumber: 16; Revision: 1.1; SheetNumber: 16; SheetTotal: 16; CurrentDate: 27.05.2014
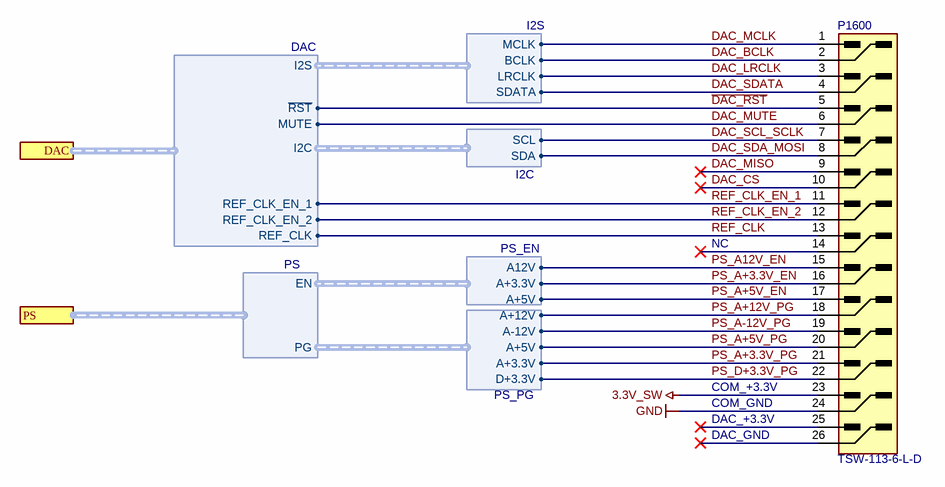
[diagram p15: DAC_Interface.SchDoc]

### Parts
P1600  TSW-113-6-L-D  [HEADER_2x13P_VERTICAL]

### Ports
DAC (harness DAC), PS (harness PS)

### Harnesses
PS: EN, PG
PS_EN: A12V, A+3.3V, A+5V
PS_PG: A+12V, A-12V, A+3.3V, A+5V, D+3.3V
DAC: I2S, ~{RST}, I2C, MUTE, REF_CLK_EN_1, REF_CLK_EN_2, REF_CLK
I2S: MCLK, BCLK, LRCLK, SDATA
I2C: SCL, SDA

### Nets
3.3V_SW: P1600.23
GND: P1600.24
~{DAC_RST}: P1600.5 ; port DAC.~{RST}
DAC_BCLK: P1600.2 ; harness I2S.BCLK
DAC_CS: P1600.10
DAC_LRCLK: P1600.3 ; harness I2S.LRCLK
DAC_MCLK: P1600.1 ; harness I2S.MCLK
DAC_MISO: P1600.9
DAC_MUTE: P1600.6 ; port DAC.MUTE
DAC_SCL_SCLK: P1600.7 ; harness I2C.SCL
DAC_SDA_MOSI: P1600.8 ; harness I2C.SDA
DAC_SDATA: P1600.4 ; harness I2S.SDATA
PS_A12V_EN: P1600.15 ; harness PS_EN.A12V
PS_A+3.3V_EN: P1600.16 ; harness PS_EN.A+3.3V
PS_A+3.3V_PG: P1600.21 ; harness PS_PG.A+3.3V
PS_A+5V_EN: P1600.17 ; harness PS_EN.A+5V
PS_A+5V_PG: P1600.20 ; harness PS_PG.A+5V
PS_A+12V_PG: P1600.18 ; harness PS_PG.A+12V
PS_A-12V_PG: P1600.19 ; harness PS_PG.A-12V
PS_D+3.3V_PG: P1600.22 ; harness PS_PG.D+3.3V
REF_CLK: P1600.13 ; port DAC.REF_CLK
REF_CLK_EN_1: P1600.11 ; port DAC.REF_CLK_EN_1
REF_CLK_EN_2: P1600.12 ; port DAC.REF_CLK_EN_2

Not connected (* = marked no-connect by the designer): P1600 14* 25* 26*

### Notes on the sheet
- NC
- COM_+3.3V
- COM_GND
- DAC_GND
- DAC_+3.3V
- Project:
- Size:
- Sheet:
- Title:
- A3
- of
- Drawn by:
- Revision:
- Date:
- Variant:
- b
- File:

### Library data of the parts
P1600 = Header 13x2P: Manufacturer Part No.: TSW-113-6-L-D

## Nets that join several sheets
3.3V: Power_Supply (16 pins), Power_Switch (17 pins), Extension (R1401.1)
3.3V_SW: Ethernet (C700.2 C701.2 D700.A D701.A), PCI_Express (C1300.2 C1301.2 C1302.2 L1300.1), Power_Supply (R200.1), Power_Switch (5 pins), RGB_Display (7 pins), RTC (R400.2 R403.2 R404.2 R405.2), Sata (7 pins), Serial (R1102.2 U1100.5), Extension (J1400.1 J1401.1), USB_Connectors (Q600.4 R605.2 R606.2), USB (7 pins), HDMI (10 pins), Audio (C800.1 C801.1 U800.1), DAC_Interface (P1600.23)
5V_SW: Power_Switch (9 pins), USB_Connectors (IC600.2 IC601.2), HDMI (C1000.2 C1001.1 IC1000.16)
AGND2: Power_Supply (X1.303 X1.304 X1.308 X1.313), Power_Switch (C329.1 IC304.2 L302.1)
AVCC: Power_Supply (X1.314 X1.320), Power_Switch (C329.2 IC304.5)
GND: Ethernet (C700.1 C701.1 C702.2 C703.1), PCI_Express (16 pins), Power_Supply (60 pins), Power_Switch (48 pins), RGB_Display (17 pins), RTC (7 pins), Sata (21 pins), Serial (15 pins), Extension (C1400.1 J1401.6 T1400.1), USB_Connectors (23 pins), USB (11 pins), HDMI (19 pins), Audio (C800.2 C801.2 U800.4), DAC_Interface (P1600.24)
SHIELD1: Power_Supply (L202.2), USB_Connectors (11 pins)
SHIELD2: Power_Supply (L203.2), USB_Connectors (X603.S1 X603.S2 X603.S3 X603.S4)
SHIELD3: Power_Supply (L204.2), HDMI (5 pins)
SHIELD4: Ethernet (X700.P1 X700.S1 X700.S2), Power_Supply (L205.2)
V_SUPPLY_FILT: Power_Supply (C201.2 C202.2 C203.2 L200.2), Power_Switch (12 pins)
VCC_INTRTC: Power_Supply (C210.2 X1.174), RTC (R401.2)
~{DAC_RST}: Audio (RA800.6), DAC_Interface (P1600.5)
DAC_BCLK: Audio (RA800.7), DAC_Interface (P1600.2)
DAC_LRCLK: Audio (RA800.8), DAC_Interface (P1600.3)
DAC_MCLK: Audio (R800.2), DAC_Interface (P1600.1)
DAC_MUTE: Extension (RA1402.8), DAC_Interface (P1600.6)
DAC_SCL_SCLK: Audio (R802.1 R804.1), DAC_Interface (P1600.7)
DAC_SDA_MOSI: Audio (R801.1 R803.1), DAC_Interface (P1600.8)
DAC_SDATA: Audio (RA800.5), DAC_Interface (P1600.4)
I2C1_SCL: PCI_Express (R1307.1), RGB_Display (X901.3), RTC (IC400.6 R404.1 RA400.7), Audio (R802.2)
I2C1_SDA: PCI_Express (R1306.1), RGB_Display (X901.4), RTC (IC400.5 R403.1 RA400.8), Audio (R801.2)
INT#: Power_Switch (IC302.5 R314.2 X300.4), Extension (X1.178)
MXM3_191_M: Miscellaneous (X1.191), Audio (R805.2)
NetR803_2: Miscellaneous (R1500.2), Audio (R803.2)
NetR804_2: Miscellaneous (R1501.2), Audio (R804.2)
PCIE1_WDISABLE#_R: PCI_Express (R1303.2), Extension (X1.176)
PS_A12V_EN: Extension (RA1400.5), DAC_Interface (P1600.15)
PS_A+3.3V_EN: Extension (RA1400.6), DAC_Interface (P1600.16)
PS_A+3.3V_PG: Extension (RA1401.6), DAC_Interface (P1600.21)
PS_A+5V_EN: Extension (RA1400.7), DAC_Interface (P1600.17)
PS_A+5V_PG: Extension (RA1401.7), DAC_Interface (P1600.20)
PS_A+12V_PG: Extension (RA1400.8), DAC_Interface (P1600.18)
PS_A-12V_PG: Extension (RA1401.8), DAC_Interface (P1600.19)
PS_D+3.3V_PG: Extension (RA1401.5), DAC_Interface (P1600.22)
RECOVERY_MODE#: Extension (R1402.2), Miscellaneous (X1.63)
REF_CLK: Audio (R805.1 U800.2), DAC_Interface (P1600.13)
REF_CLK_EN_1: Extension (RA1402.7), DAC_Interface (P1600.11)
REF_CLK_EN_2: Extension (RA1402.6), DAC_Interface (P1600.12)
RESET_MOCI#: PCI_Express (X1300.52), Power_Switch (IC303.1 RA300.7), RGB_Display (T900.1)
TOUCH_INT#: RGB_Display (X901.5), Extension (RA1403.8)
TOUCH_RESET#: RGB_Display (X901.6), Extension (RA1403.7)
USBH2_D_N: PCI_Express (R1308.1), USB_Connectors (R600.1), USB (X1.82)
USBH2_D_P: PCI_Express (R1309.1), USB_Connectors (R601.1), USB (X1.80)
USBH3_D_N: PCI_Express (R1310.1), USB_Connectors (R602.1), USB (X1.88)
USBH3_D_P: PCI_Express (R1311.1), USB_Connectors (R603.1), USB (X1.86)
USBH4_D_N: USB_Connectors (L604.1), USB (X1.100)
USBH4_D_P: USB_Connectors (L604.2), USB (X1.98)
USBH4_SSRX_N: USB_Connectors (D601.2 X602.5), USB (X1.92)
USBH4_SSRX_P: USB_Connectors (D601.1 X602.6), USB (X1.94)
USBH4_SSTX_N: USB_Connectors (D602.2 X602.8), USB (X1.104)
USBH4_SSTX_P: USB_Connectors (D602.1 X602.9), USB (X1.106)
USBH_EN: USB_Connectors (IC600.3 IC600.4), USB (R504.2 RA500.7)
USBH_OC#: USB_Connectors (IC600.5 IC600.8), USB (R503.2 RA500.8)
USBO1_D_N: USB_Connectors (L606.2), USB (X1.76)
USBO1_D_P: USB_Connectors (L606.1), USB (X1.74)
USBO1_EN: USB_Connectors (IC601.3), USB (R501.2 R502.2)
USBO1_ID: USB_Connectors (Q600.3 R607.2), USB (RA500.6)
USBO1_OC#: USB_Connectors (IC601.8 R605.1), USB (R500.2)
USBO1_SSRX_N: USB_Connectors (D605.2 X603.5), USB (X1.64)
USBO1_SSRX_P: USB_Connectors (D605.1 X603.6), USB (X1.62)
USBO1_SSTX_N: USB_Connectors (D606.1 X603.8), USB (X1.70)
USBO1_SSTX_P: USB_Connectors (D606.2 X603.9), USB (X1.68)
USBO1_VBUS: USB_Connectors (R604.1), USB (RA500.5)
WAKE1_MICO#: PCI_Express (R1305.1), Power_Switch (R324.1 R325.2)

## Assembly variants
Complete: not fitted C313 C320 C400 C401 R310 R323 R401 R600 R601 R803 R804 R805 R902 R1310 R1311 R1402 T900 X601